# EAGLE schematic quantum_AnalougeEngine_V4_0 (EAGLE 9.5.2)

## Sheet 1 of 11: Voltages
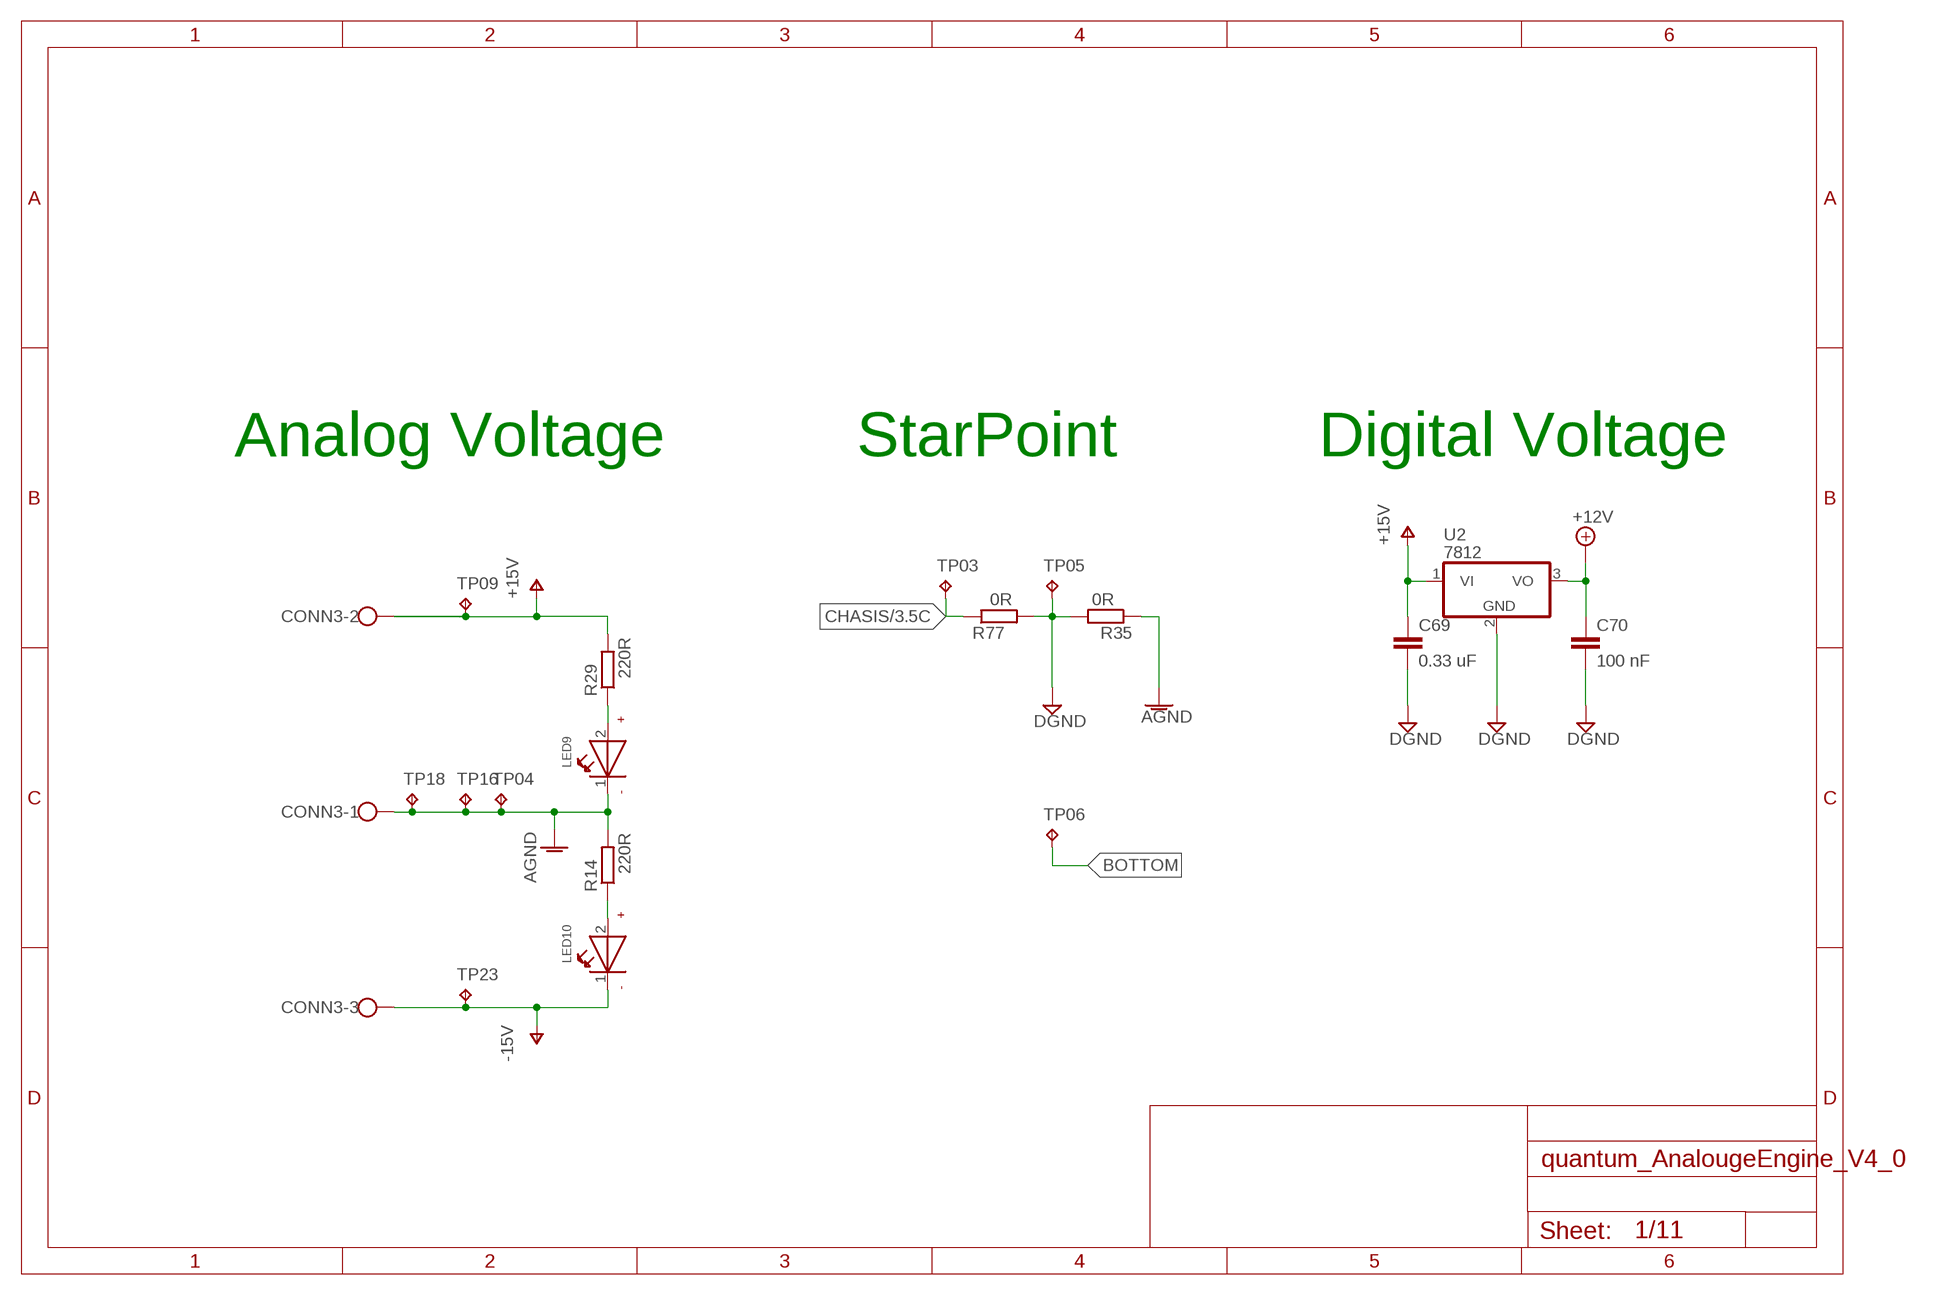
[diagram p0: schematic, sheet 1]

### Parts
C69  0.33 uF  CAPACITOR"  [C0603]
C70  100 nF  CAPACITOR"  [C0603]
CONN3  SCHRAUBKLEMME_3POL  [W237-103]
LED9  LED_GREEN_SMD  [WL-SMCW_0603]
LED10  LED_GREEN_SMD  [WL-SMCW_0603]
R14  220R  RESISTOR  [R0603]
R29  220R  RESISTOR  [R0603]
R35  0R  RESISTOR  [R0603]
R77  0R  RESISTOR  [R0603]
TP03  TPTHT  [THT_PIN]
TP04  TPTHT  [THT_PIN]
TP05  TPTHT  [THT_PIN]
TP06  TPTHT  [THT_PIN]
TP09  TPTHT  [THT_PIN]
TP16  TPTHT  [THT_PIN]
TP18  TPTHT  [THT_PIN]
TP23  TPTHT  [THT_PIN]
U2  7812  78  [TO252]

### Nets
+12V: C70.1 U2.3(VO) ; also sheet 2,9
AGND: CONN3.1 LED9.1(-) R14.2 R35.1 TP04.P$1(TP) TP16.P$1(TP) TP18.P$1(TP) ; also sheet 3,4,5,6,7,8,10,11
BOTTOM: TP06.P$1(TP)
CHASIS: R77.1 TP03.P$1(TP) ; also sheet 3,4
DGND: C69.2 C70.2 R35.2 R77.2 TP05.P$1(TP) U2.2(GND) ; also sheet 2,9,10,11
N$50: LED10.2(+) R14.1
N$52: LED9.2(+) R29.1
V+: C69.1 CONN3.2 R29.2 TP09.P$1(TP) U2.1(VI) ; supply symbol labelled +15V ; also sheet 3,4,5,6,7,8,10,11
V-: CONN3.3 LED10.1(-) TP23.P$1(TP) ; supply symbol labelled -15V ; also sheet 3,4,5,6,7,8,10,11

### Notes on the sheet
- Analog Voltage | StarPoint | Digital Voltage

## Sheet 2 of 11: Relais
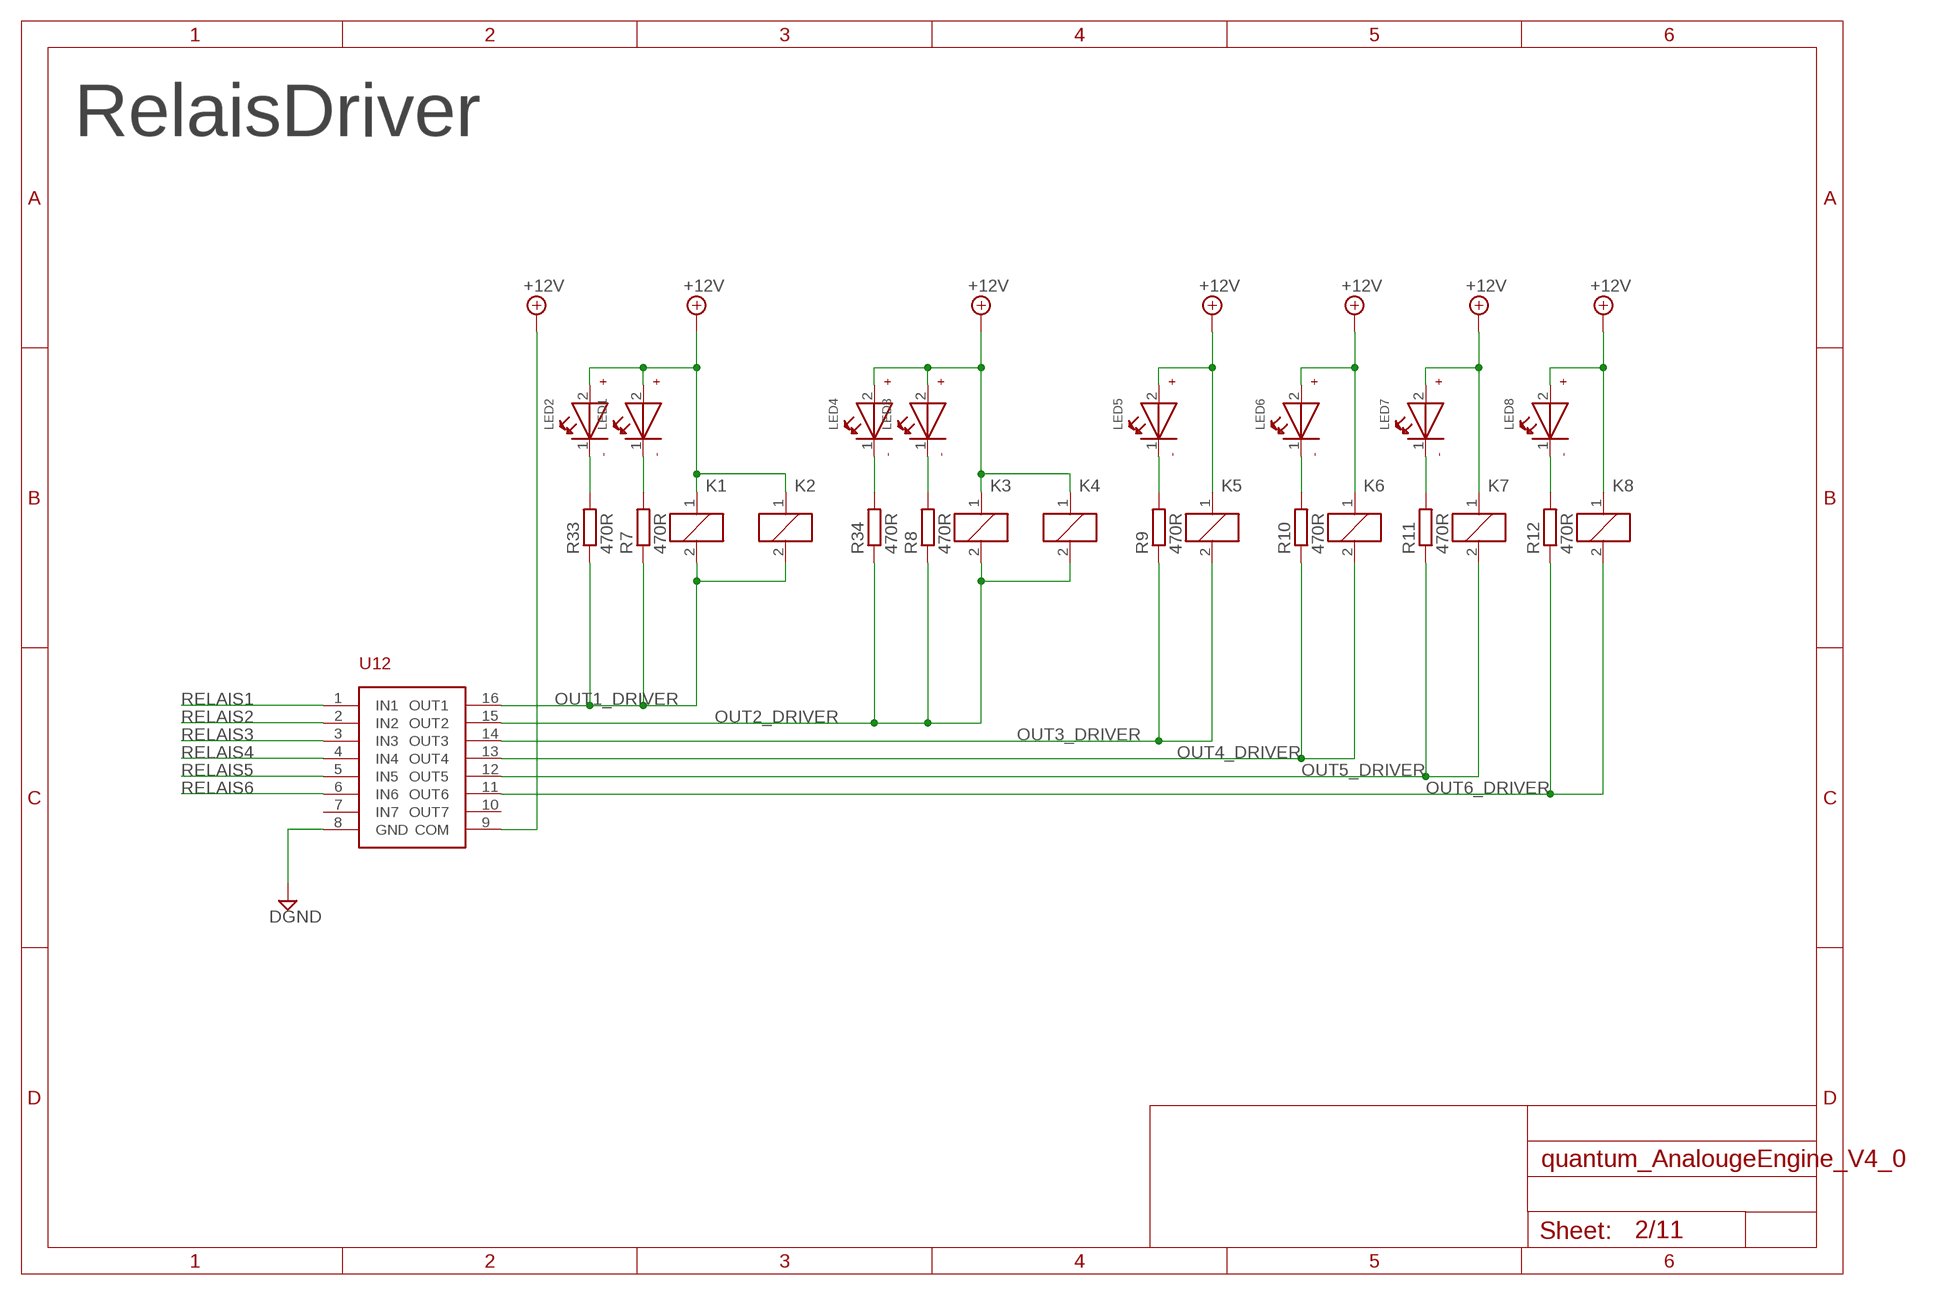
[diagram p1: schematic, sheet 2]

### Parts
K1  K1  RELAY_EE2-5NU  [351]
K2  K2  RELAY_EE2-5NU  [351]
K3  K3  RELAY_EE2-5NU  [351]
K4  K4  RELAY_EE2-5NU  [351]
K5  K5  RELAY_EE2-5NU  [351]
K6  K6  RELAY_EE2-5NU  [351]
K7  K7  RELAY_EE2-5NU  [351]
K8  K8  RELAY_EE2-5NU  [351]
LED1  LED_BLUE_SMD  [WL-SMCW_0603]
LED2  LED_BLUE_SMD  [WL-SMCW_0603]
LED3  LED_BLUE_SMD  [WL-SMCW_0603]
LED4  LED_BLUE_SMD  [WL-SMCW_0603]
LED5  LED_BLUE_SMD  [WL-SMCW_0603]
LED6  LED_BLUE_SMD  [WL-SMCW_0603]
LED7  LED_BLUE_SMD  [WL-SMCW_0603]
LED8  LED_BLUE_SMD  [WL-SMCW_0603]
R7  470R  RESISTOR  [R0603]
R8  470R  RESISTOR  [R0603]
R9  470R  RESISTOR  [R0603]
R10  470R  RESISTOR  [R0603]
R11  470R  RESISTOR  [R0603]
R12  470R  RESISTOR  [R0603]
R33  470R  RESISTOR  [R0603]
R34  470R  RESISTOR  [R0603]
U12  ULN2003  [SOIC16]

### Nets
+12V: K1.1 K2.1 K3.1 K4.1 K5.1 K6.1 K7.1 K8.1 LED1.2(+) LED2.2(+) LED3.2(+) LED4.2(+) LED5.2(+) LED6.2(+) LED7.2(+) LED8.2(+) U12.9(COM) ; also sheet 1,9
DGND: U12.8(GND) ; also sheet 1,9,10,11
N$14: LED1.1(-) R7.2
N$16: LED3.1(-) R8.2
N$26: LED8.1(-) R12.2
N$29: LED7.1(-) R11.2
N$30: LED6.1(-) R10.2
N$32: LED5.1(-) R9.2
N$49: LED2.1(-) R33.2
N$51: LED4.1(-) R34.2
OUT1_DRIVER: K1.2 K2.2 R7.1 R33.1 U12.16(OUT1)
OUT2_DRIVER: K3.2 K4.2 R8.1 R34.1 U12.15(OUT2)
OUT3_DRIVER: K5.2 R9.1 U12.14(OUT3)
OUT4_DRIVER: K6.2 R10.1 U12.13(OUT4)
OUT5_DRIVER: K7.2 R11.1 U12.12(OUT5)
OUT6_DRIVER: K8.2 R12.1 U12.11(OUT6)
RELAIS1: U12.1(IN1) ; also sheet 9
RELAIS2: U12.2(IN2) ; also sheet 9
RELAIS3: U12.3(IN3) ; also sheet 9
RELAIS4: U12.4(IN4) ; also sheet 9
RELAIS5: U12.5(IN5) ; also sheet 9
RELAIS6: U12.6(IN6) ; also sheet 9
Unconnected: U12.7(IN7) U12.10(OUT7)

### Notes on the sheet
- RelaisDriver

## Sheet 3 of 11: Right I/O Section
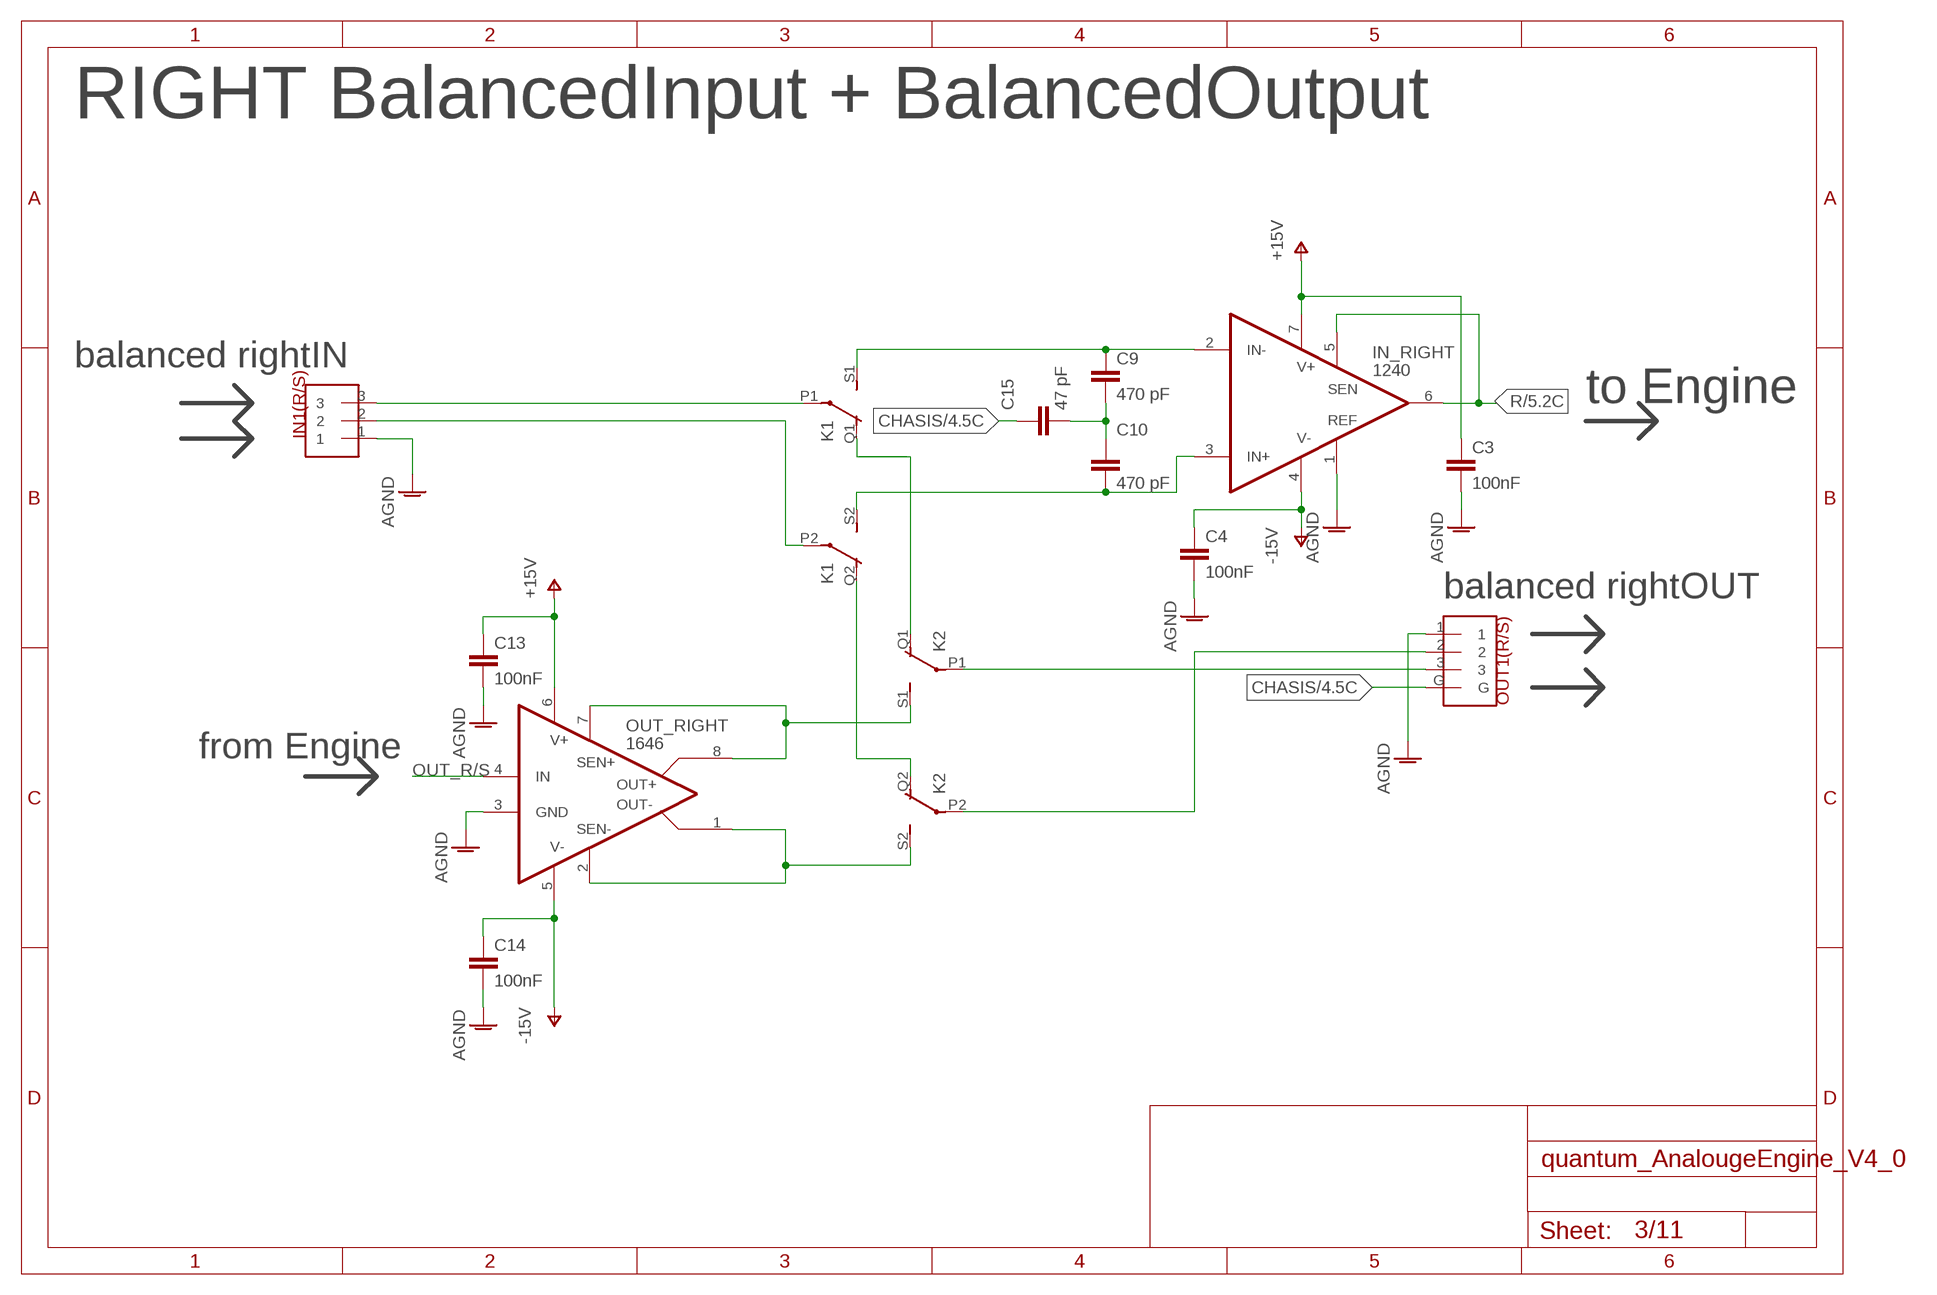
[diagram p2: schematic, sheet 3]

### Parts
C3  100nF  CAPACITOR"  [C0603]
C4  100nF  CAPACITOR"  [C0603]
C9  470 pF  CAPACITOR"  [C0603]
C10  470 pF  CAPACITOR"  [C0603]
C13  100nF  CAPACITOR"  [C0603]
C14  100nF  CAPACITOR"  [C0603]
C15  47 pF  CAPACITOR"  [C0603]
IN1(R/S)  NEUTRIK_NC3FAH  [NEUTRIK_NC3FAH]
IN_RIGHT  1240  THAT1240SO8-USO8-U  [SO08]
OUT1(R/S)  NEUTRIK_NC3MAH  [NEUTRIK_NC3MAH]
OUT_RIGHT  1646  THAT1646SO8-USO8-U  [SO08]

### Nets
AGND: C3.2 C4.2 C13.2 C14.2 IN1(R/S).1 IN_RIGHT.1(REF) OUT1(R/S).1 OUT_RIGHT.3(GND) ; also sheet 1,4,5,6,7,8,10,11
CHASIS: C15.1 OUT1(R/S).G ; also sheet 1,4
N$1: C9.1 IN_RIGHT.2(IN-) K1.S1(2:S)
N$2: C10.2 IN_RIGHT.3(IN+) K1.S2(3:S)
N$3: C9.2 C10.1 C15.2
N$8: K1.Q1(2:O) K2.Q1(2:O)
N$11: K1.Q2(3:O) K2.Q2(3:O)
N$21: IN1(R/S).2 K1.P2(3:P)
N$22: IN1(R/S).3 K1.P1(2:P)
N$23: K2.P2(3:P) OUT1(R/S).2
N$24: K2.P1(2:P) OUT1(R/S).3
OUT_R/S: OUT_RIGHT.4(IN) ; also sheet 8
R: IN_RIGHT.5(SEN) IN_RIGHT.6(OUT) ; also sheet 5
R/S_OUT+: K2.S1(2:S) OUT_RIGHT.7(SEN+) OUT_RIGHT.8(OUT+)
R/S_OUT-: K2.S2(3:S) OUT_RIGHT.1(OUT-) OUT_RIGHT.2(SEN-)
V+: C3.1 C13.1 IN_RIGHT.7(V+) OUT_RIGHT.6(V+) ; supply symbol labelled +15V ; also sheet 1,4,5,6,7,8,10,11
V-: C4.1 C14.1 IN_RIGHT.4(V-) OUT_RIGHT.5(V-) ; supply symbol labelled -15V ; also sheet 1,4,5,6,7,8,10,11

### Notes on the sheet
- RIGHT BalancedInput + BalancedOutput
- balanced rightIN
- to Engine
- balanced rightOUT
- from Engine

## Sheet 4 of 11: Left I/O Section
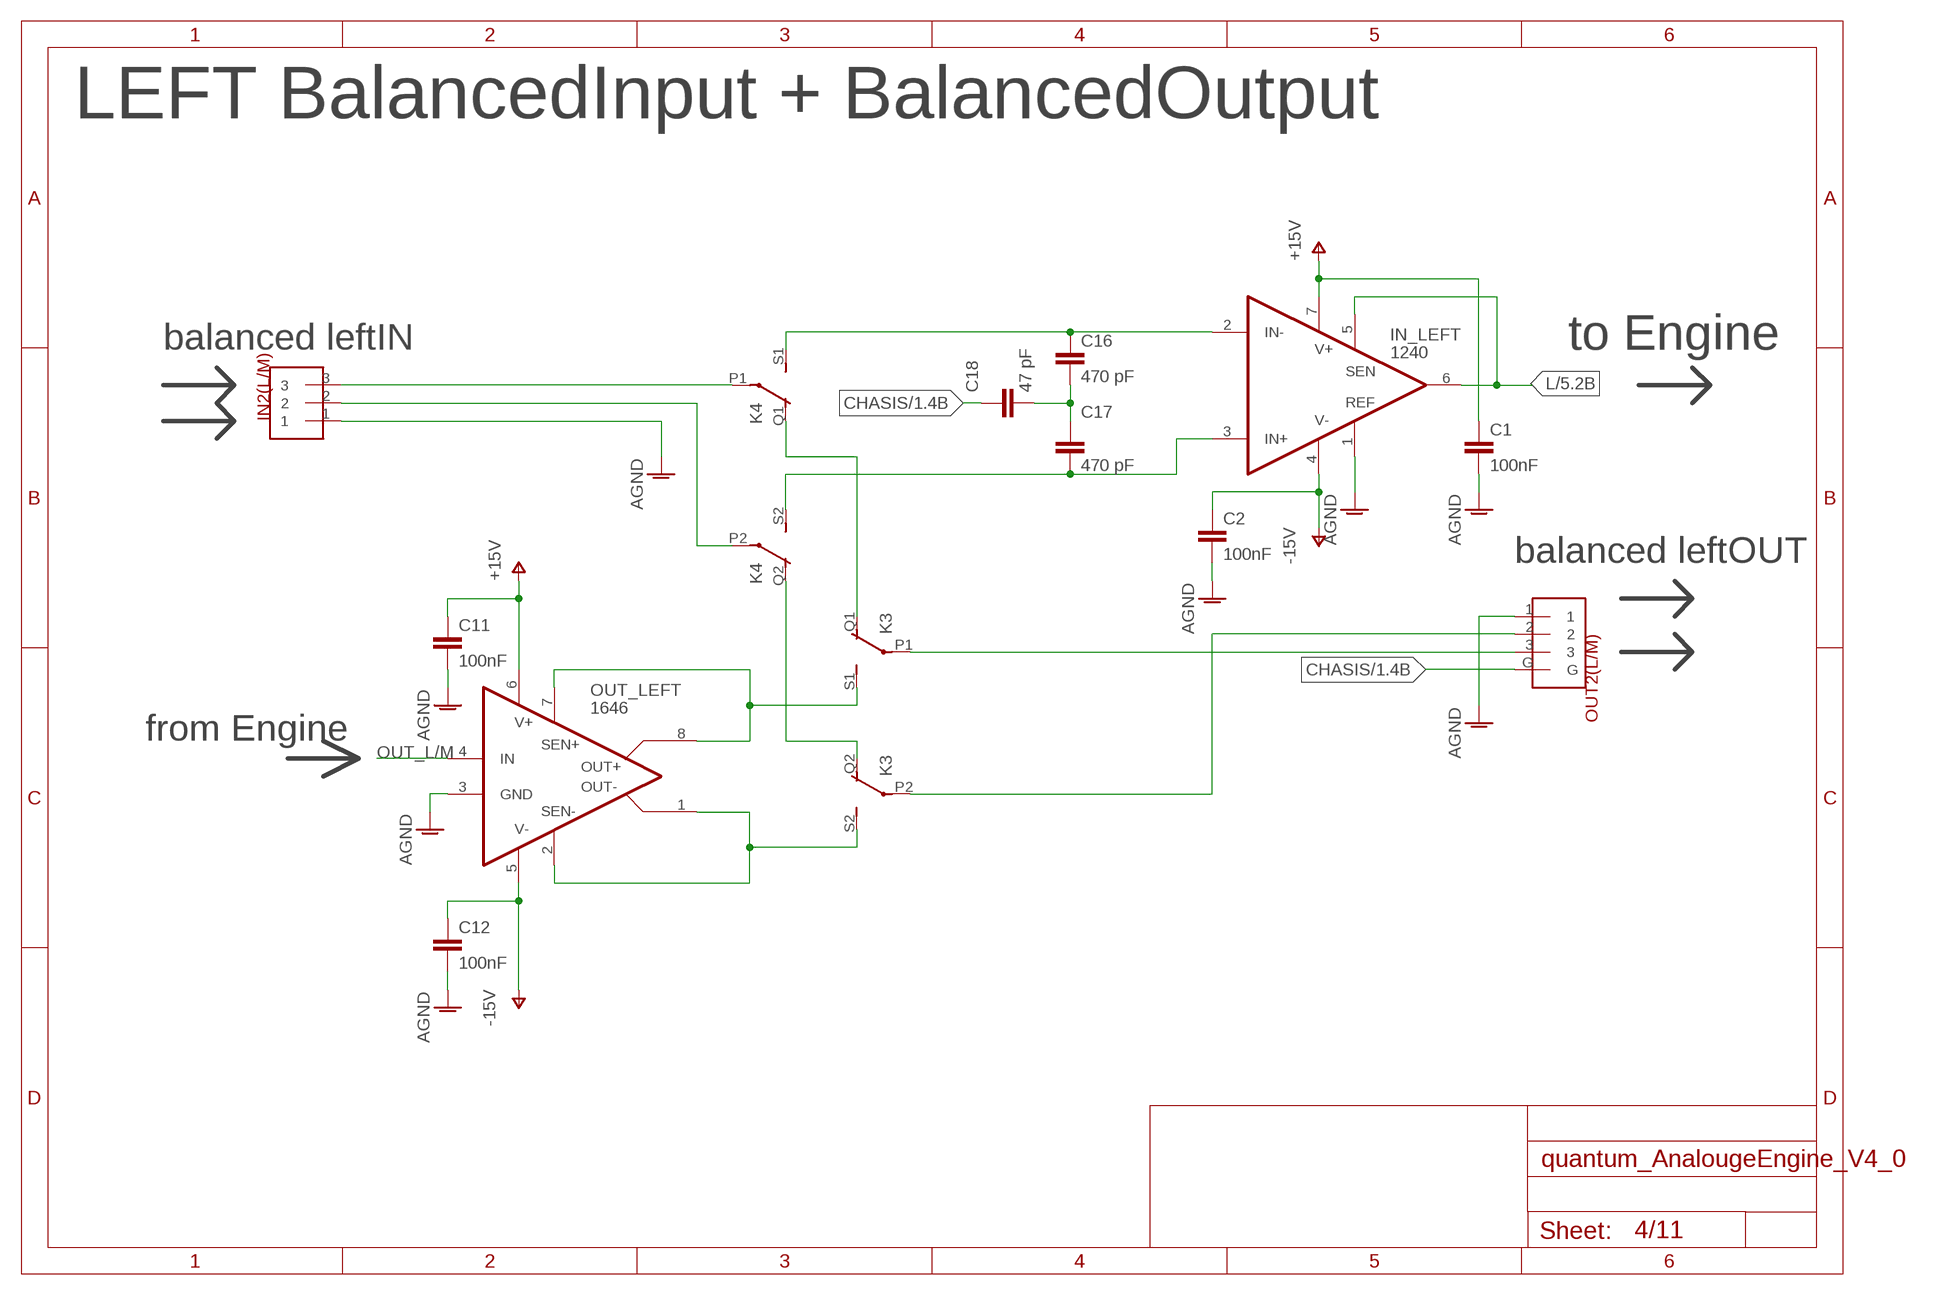
[diagram p3: schematic, sheet 4]

### Parts
C1  100nF  CAPACITOR"  [C0603]
C2  100nF  CAPACITOR"  [C0603]
C11  100nF  CAPACITOR"  [C0603]
C12  100nF  CAPACITOR"  [C0603]
C16  470 pF  CAPACITOR"  [C0603]
C17  470 pF  CAPACITOR"  [C0603]
C18  47 pF  CAPACITOR"  [C0603]
IN2(L/M)  NEUTRIK_NC3FAH  [NEUTRIK_NC3FAH]
IN_LEFT  1240  THAT1240SO8-USO8-U  [SO08]
OUT2(L/M)  NEUTRIK_NC3MAH  [NEUTRIK_NC3MAH]
OUT_LEFT  1646  THAT1646SO8-USO8-U  [SO08]

### Nets
AGND: C1.2 C2.2 C11.2 C12.2 IN2(L/M).1 IN_LEFT.1(REF) OUT2(L/M).1 OUT_LEFT.3(GND) ; also sheet 1,3,5,6,7,8,10,11
CHASIS: C18.1 OUT2(L/M).G ; also sheet 1,3
L: IN_LEFT.5(SEN) IN_LEFT.6(OUT) ; also sheet 5
L/M_OUT+: K3.S1(2:S) OUT_LEFT.7(SEN+) OUT_LEFT.8(OUT+)
L/M_OUT-: K3.S2(3:S) OUT_LEFT.1(OUT-) OUT_LEFT.2(SEN-)
N$7: C17.2 IN_LEFT.3(IN+) K4.S2(3:S)
N$9: C16.2 C17.1 C18.2
N$13: C16.1 IN_LEFT.2(IN-) K4.S1(2:S)
N$15: K3.P1(2:P) OUT2(L/M).3
N$17: K3.P2(3:P) OUT2(L/M).2
N$25: IN2(L/M).3 K4.P1(2:P)
N$27: IN2(L/M).2 K4.P2(3:P)
N$28: K3.Q1(2:O) K4.Q1(2:O)
N$31: K3.Q2(3:O) K4.Q2(3:O)
OUT_L/M: OUT_LEFT.4(IN) ; also sheet 8
V+: C1.1 C11.1 IN_LEFT.7(V+) OUT_LEFT.6(V+) ; supply symbol labelled +15V ; also sheet 1,3,5,6,7,8,10,11
V-: C2.1 C12.1 IN_LEFT.4(V-) OUT_LEFT.5(V-) ; supply symbol labelled -15V ; also sheet 1,3,5,6,7,8,10,11

### Notes on the sheet
- LEFT BalancedInput + BalancedOutput
- balanced leftIN | to Engine
- balanced leftOUT
- from Engine

## Sheet 5 of 11: MS Encode
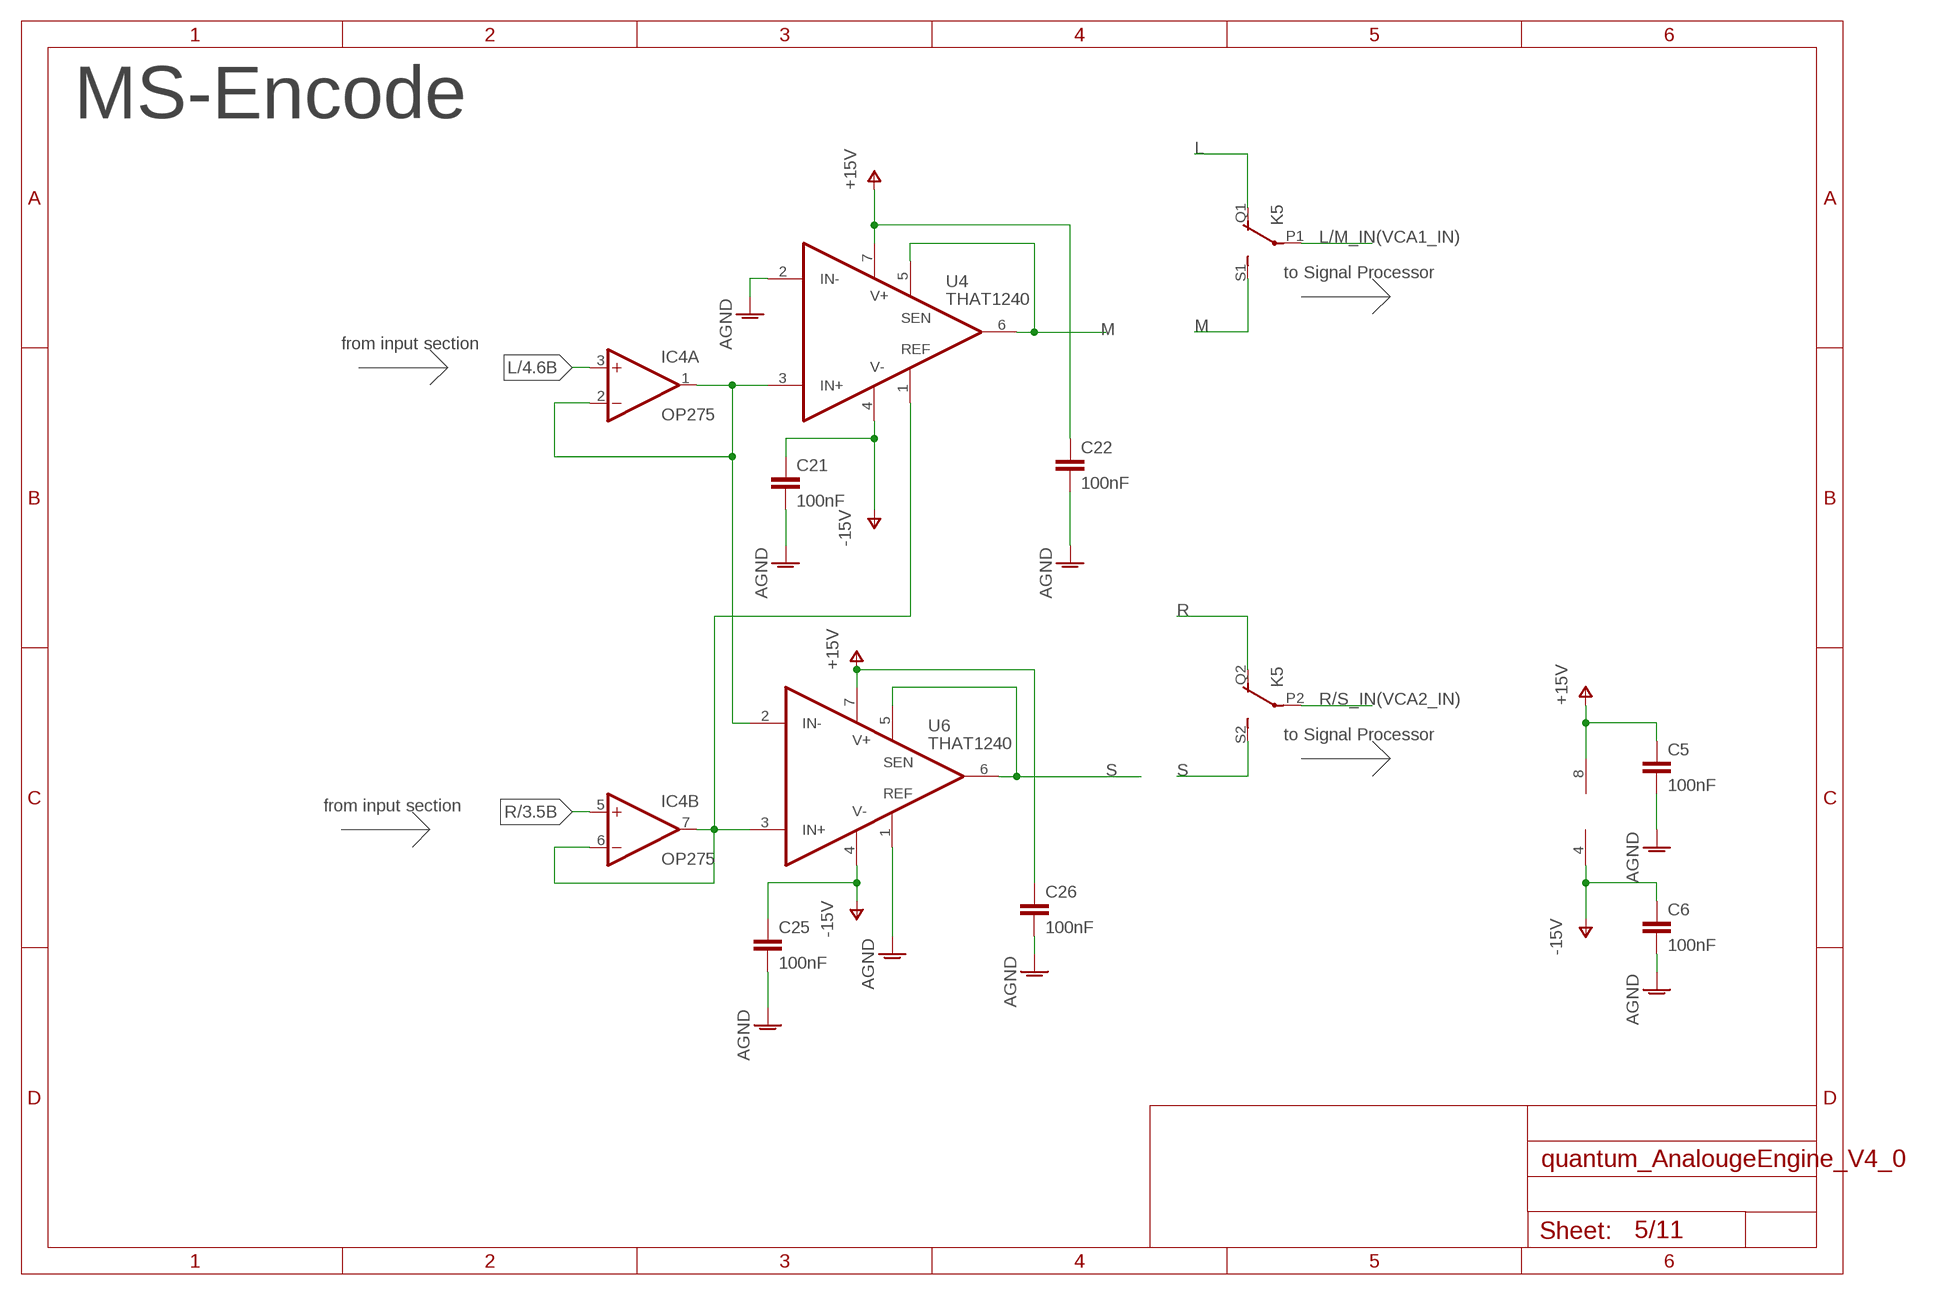
[diagram p4: schematic, sheet 5]

### Parts
C5  100nF  CAPACITOR"  [C0603]
C6  100nF  CAPACITOR"  [C0603]
C21  100nF  CAPACITOR"  [C0603]
C22  100nF  CAPACITOR"  [C0603]
C25  100nF  CAPACITOR"  [C0603]
C26  100nF  CAPACITOR"  [C0603]
IC4  OP275  [SOIC8]
U4  THAT1240  THAT1240SO8-USO8-U  [SO08]
U6  THAT1240  THAT1240SO8-USO8-U  [SO08]

### Nets
AGND: C5.2 C6.2 C21.2 C22.2 C25.2 C26.2 U4.2(IN-) U6.1(REF) ; also sheet 1,3,4,6,7,8,10,11
L: IC4.3(A:+IN) K5.Q1(2:O) ; also sheet 4
L/M_IN(VCA1_IN): K5.P1(2:P) ; also sheet 6,10
M: K5.S1(2:S) U4.5(SEN) U4.6(OUT)
N$18: IC4.1(A:OUT) IC4.2(A:-IN) U4.3(IN+) U6.2(IN-)
N$33: IC4.6(B:-IN) IC4.7(B:OUT) U4.1(REF) U6.3(IN+)
R: IC4.5(B:+IN) K5.Q2(3:O) ; also sheet 3
R/S_IN(VCA2_IN): K5.P2(3:P) ; also sheet 6,10
S: K5.S2(3:S) U6.5(SEN) U6.6(OUT)
V+: C5.1 C22.1 C26.1 IC4.8(P:V+) U4.7(V+) U6.7(V+) ; supply symbol labelled +15V ; also sheet 1,3,4,6,7,8,10,11
V-: C6.1 C21.1 C25.1 IC4.4(P:V-) U4.4(V-) U6.4(V-) ; supply symbol labelled -15V ; also sheet 1,3,4,6,7,8,10,11

### Notes on the sheet
- MS-Encode
- to Signal Processor
- from input section
- to Signal Processor
- from input section

## Sheet 6 of 11: VCA
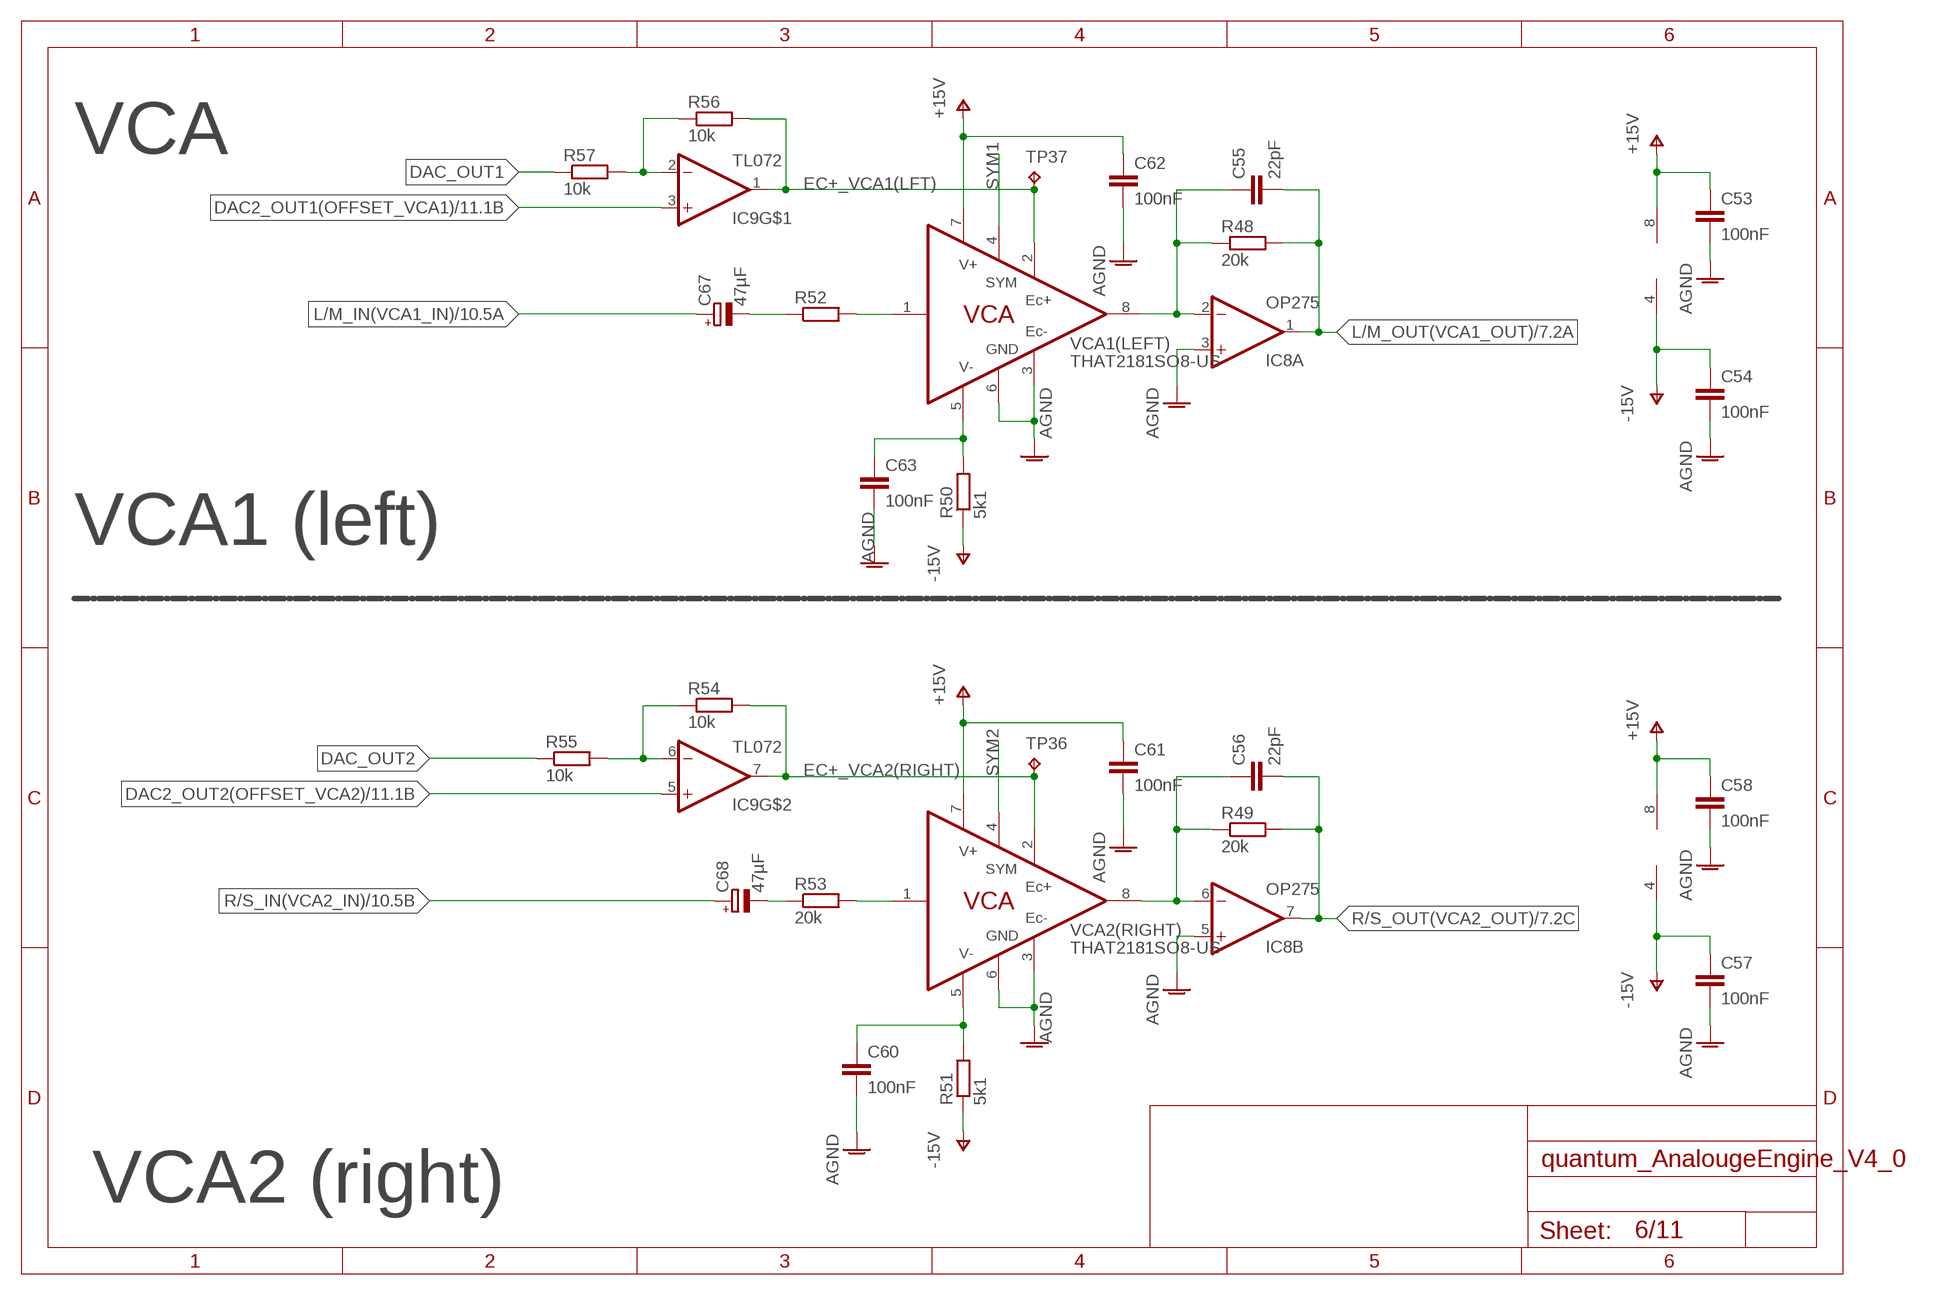
[diagram p5: schematic, sheet 6]

### Parts
C53  100nF  CAPACITOR"  [C0603]
C54  100nF  CAPACITOR"  [C0603]
C55  22pF  CAPACITOR"  [C0603]
C56  22pF  CAPACITOR"  [C0603]
C57  100nF  CAPACITOR"  [C0603]
C58  100nF  CAPACITOR"  [C0603]
C60  100nF  CAPACITOR"  [C0603]
C61  100nF  CAPACITOR"  [C0603]
C62  100nF  CAPACITOR"  [C0603]
C63  100nF  CAPACITOR"  [C0603]
C67  47µF  ELECTROLYTICELCTROLYTIC_MIDSIZE_SMD  [CAPAE400X550N]
C68  47µF  ELECTROLYTICELCTROLYTIC_MIDSIZE_SMD  [CAPAE400X550N]
IC8  OP275  [SOIC8]
IC9  TL072  [SOIC8]
R48  20k  RESISTOR  [R0603]
R49  20k  RESISTOR  [R0603]
R50  5k1  RESISTOR  [R0603]
R51  5k1  RESISTOR  [R0603]
R52  20k  RESISTOR  [R0603]
R53  20k  RESISTOR  [R0603]
R54  10k  RESISTOR  [R0603]
R55  10k  RESISTOR  [R0603]
R56  10k  RESISTOR  [R0603]
R57  10k  RESISTOR  [R0603]
TP36  TPTHT  [THT_PIN]
TP37  TPTHT  [THT_PIN]
VCA1(LEFT)  THAT2181SO8-US  [SO08]
VCA2(RIGHT)  THAT2181SO8-US  [SO08]

### Nets
AGND: C53.2 C54.2 C57.2 C58.2 C60.2 C61.2 C62.2 C63.2 IC8.3(A:+IN) IC8.5(B:+IN) VCA1(LEFT).3(EC-) VCA1(LEFT).6(GND) VCA2(RIGHT).3(EC-) VCA2(RIGHT).6(GND) ; also sheet 1,3,4,5,7,8,10,11
DAC2_OUT1(OFFSET_VCA1): IC9.3(+IN) ; also sheet 11
DAC2_OUT2(OFFSET_VCA2): IC9.5(+IN) ; also sheet 11
DAC_OUT1: R57.1 ; also sheet 9
DAC_OUT2: R55.1 ; also sheet 9
EC+_VCA1(LFT): IC9.1(OUT) R56.2 TP37.P$1(TP) VCA1(LEFT).2(EC+)
EC+_VCA2(RIGHT): IC9.7(OUT) R54.2 TP36.P$1(TP) VCA2(RIGHT).2(EC+)
L/M_IN(VCA1_IN): C67.1(+) ; also sheet 5,10
L/M_OUT(VCA1_OUT): C55.2 IC8.1(A:OUT) R48.2 ; also sheet 7,10
N$63: IC9.2(-IN) R56.1 R57.2
N$64: C55.1 IC8.2(A:-IN) R48.1 VCA1(LEFT).8(OUT)
N$65: R52.2 VCA1(LEFT).1(IN)
N$71: C67.2(-) R52.1
N$75: C56.1 IC8.6(B:-IN) R49.1 VCA2(RIGHT).8(OUT)
N$77: C60.1 R51.2 VCA2(RIGHT).5(V-)
N$78: C68.2(-) R53.1
N$79: R53.2 VCA2(RIGHT).1(IN)
N$80: C63.1 R50.2 VCA1(LEFT).5(V-)
N$81: IC9.6(-IN) R54.1 R55.2
R/S_IN(VCA2_IN): C68.1(+) ; also sheet 5,10
R/S_OUT(VCA2_OUT): C56.2 IC8.7(B:OUT) R49.2 ; also sheet 7,10
SYM1: VCA1(LEFT).4(SYM) ; also sheet 11
SYM2: VCA2(RIGHT).4(SYM) ; also sheet 11
V+: C53.1 C58.1 C61.1 C62.1 IC8.8(P:V+) IC9.8(V+) VCA1(LEFT).7(V+) VCA2(RIGHT).7(V+) ; supply symbol labelled +15V ; also sheet 1,3,4,5,7,8,10,11
V-: C54.1 C57.1 IC8.4(P:V-) IC9.4(V-) R50.1 R51.1 ; supply symbol labelled -15V ; also sheet 1,3,4,5,7,8,10,11

### Notes on the sheet
- VCA
- VCA1 (left)
- VCA2 (right)

## Sheet 7 of 11: Output Stage
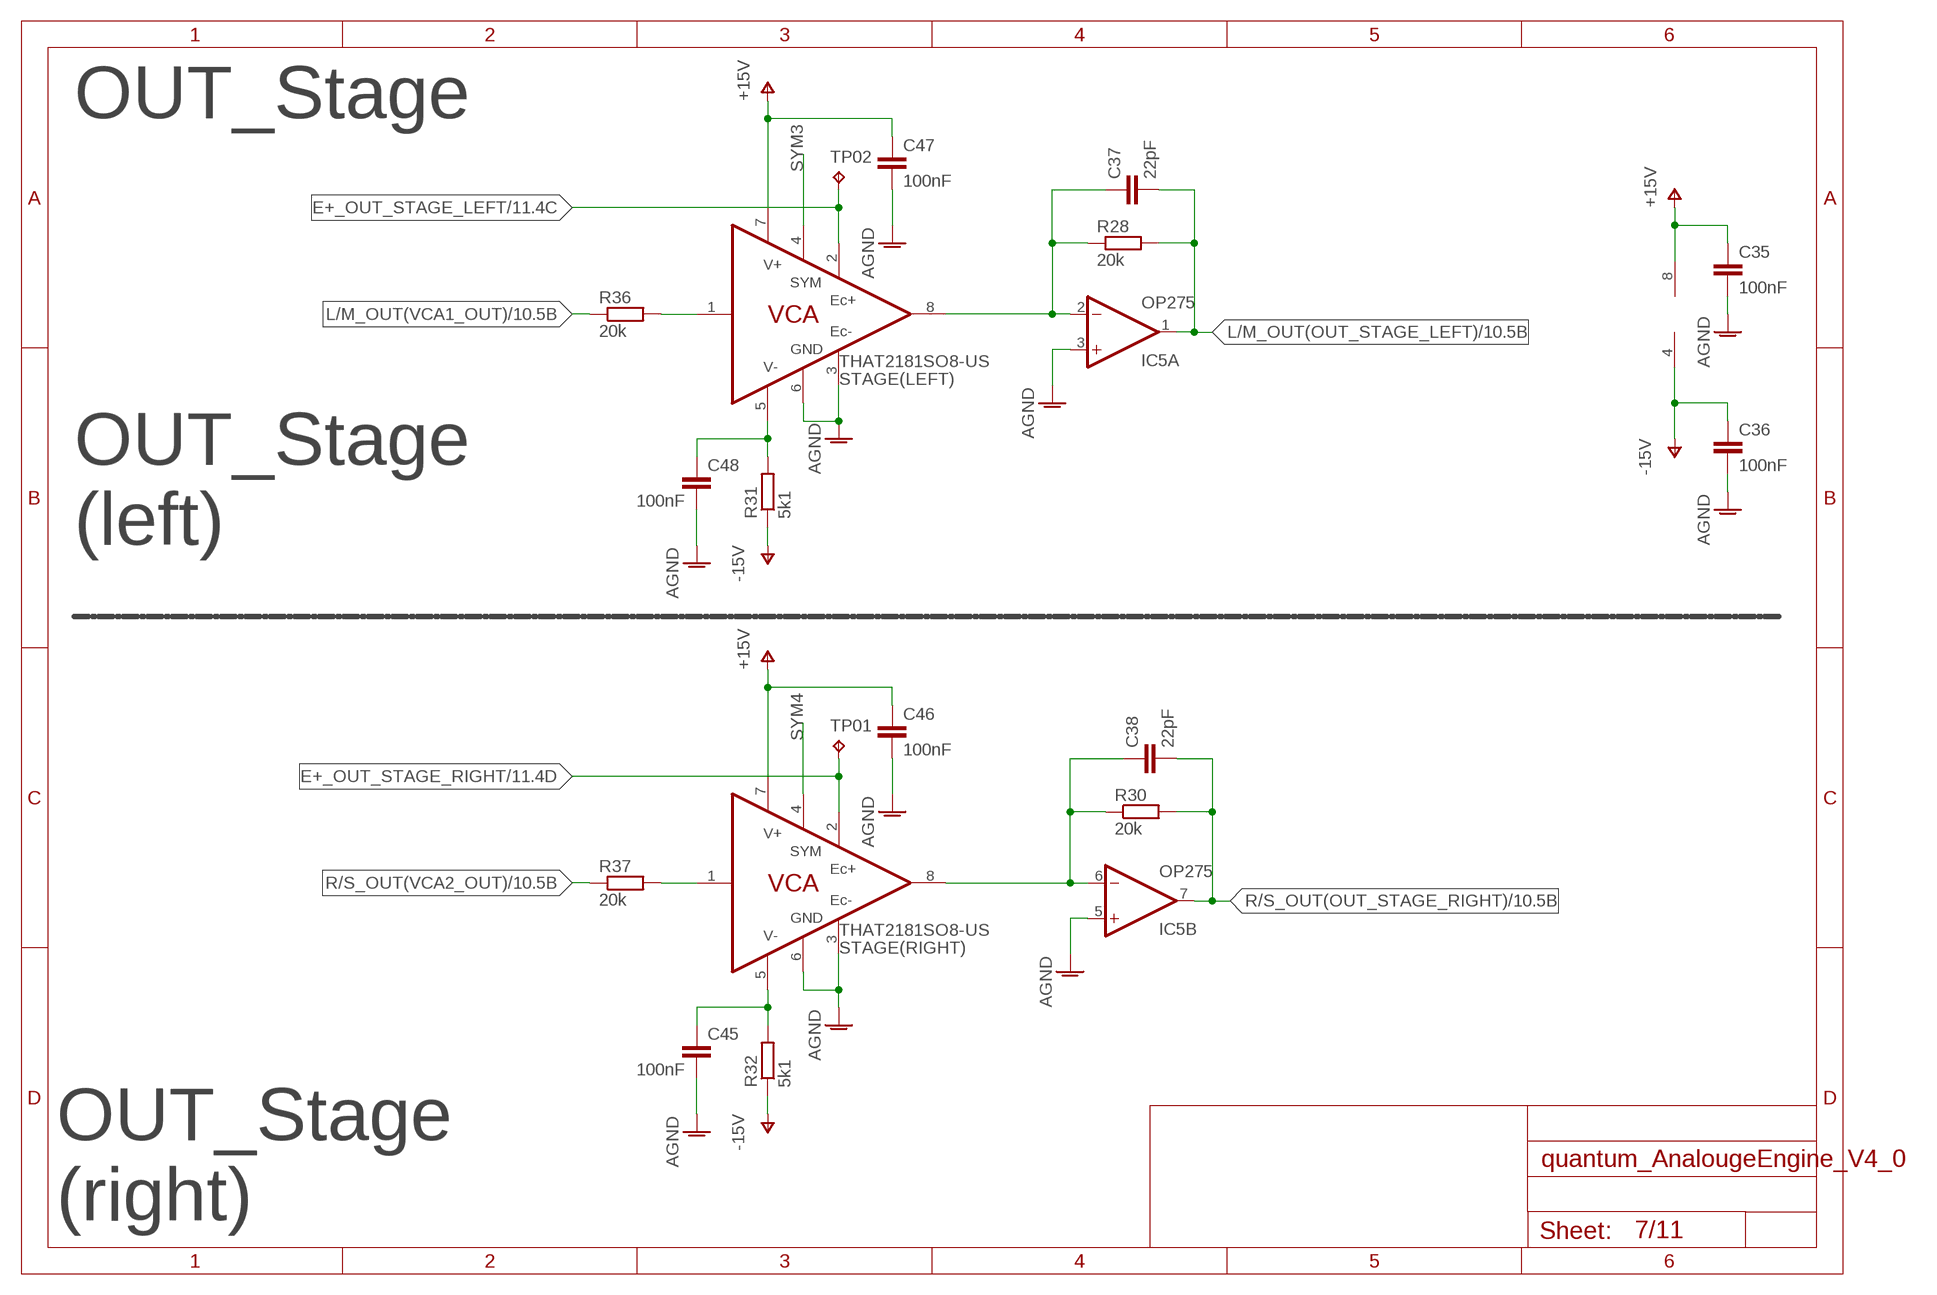
[diagram p6: schematic, sheet 7]

### Parts
C35  100nF  CAPACITOR"  [C0603]
C36  100nF  CAPACITOR"  [C0603]
C37  22pF  CAPACITOR"  [C0603]
C38  22pF  CAPACITOR"  [C0603]
C45  100nF  CAPACITOR"  [C0603]
C46  100nF  CAPACITOR"  [C0603]
C47  100nF  CAPACITOR"  [C0603]
C48  100nF  CAPACITOR"  [C0603]
IC5  OP275  [SOIC8]
R28  20k  RESISTOR  [R0603]
R30  20k  RESISTOR  [R0603]
R31  5k1  RESISTOR  [R0603]
R32  5k1  RESISTOR  [R0603]
R36  20k  RESISTOR  [R0603]
R37  20k  RESISTOR  [R0603]
STAGE(LEFT)  THAT2181SO8-US  [SO08]
STAGE(RIGHT)  THAT2181SO8-US  [SO08]
TP01  TPTHT  [THT_PIN]
TP02  TPTHT  [THT_PIN]

### Nets
AGND: C35.2 C36.2 C45.2 C46.2 C47.2 C48.2 IC5.3(A:+IN) IC5.5(B:+IN) STAGE(LEFT).3(EC-) STAGE(LEFT).6(GND) STAGE(RIGHT).3(EC-) STAGE(RIGHT).6(GND) ; also sheet 1,3,4,5,6,8,10,11
E+_OUT_STAGE_LEFT: STAGE(LEFT).2(EC+) TP02.P$1(TP) ; also sheet 11
E+_OUT_STAGE_RIGHT: STAGE(RIGHT).2(EC+) TP01.P$1(TP) ; also sheet 11
L/M_OUT(OUT_STAGE_LEFT): C37.2 IC5.1(A:OUT) R28.2 ; also sheet 8,10
L/M_OUT(VCA1_OUT): R36.1 ; also sheet 6,10
N$48: C37.1 IC5.2(A:-IN) R28.1 STAGE(LEFT).8(OUT)
N$53: C38.1 IC5.6(B:-IN) R30.1 STAGE(RIGHT).8(OUT)
N$54: C45.1 R32.2 STAGE(RIGHT).5(V-)
N$55: R36.2 STAGE(LEFT).1(IN)
N$68: R37.2 STAGE(RIGHT).1(IN)
N$73: C48.1 R31.2 STAGE(LEFT).5(V-)
R/S_OUT(OUT_STAGE_RIGHT): C38.2 IC5.7(B:OUT) R30.2 ; also sheet 8,10
R/S_OUT(VCA2_OUT): R37.1 ; also sheet 6,10
SYM3: STAGE(LEFT).4(SYM) ; also sheet 11
SYM4: STAGE(RIGHT).4(SYM) ; also sheet 11
V+: C35.1 C46.1 C47.1 IC5.8(P:V+) STAGE(LEFT).7(V+) STAGE(RIGHT).7(V+) ; supply symbol labelled +15V ; also sheet 1,3,4,5,6,8,10,11
V-: C36.1 IC5.4(P:V-) R31.1 R32.1 ; supply symbol labelled -15V ; also sheet 1,3,4,5,6,8,10,11

### Notes on the sheet
- OUT_Stage
- OUT_Stage 
  (left)
- OUT_Stage 
  (right)

## Sheet 8 of 11: MS Decode
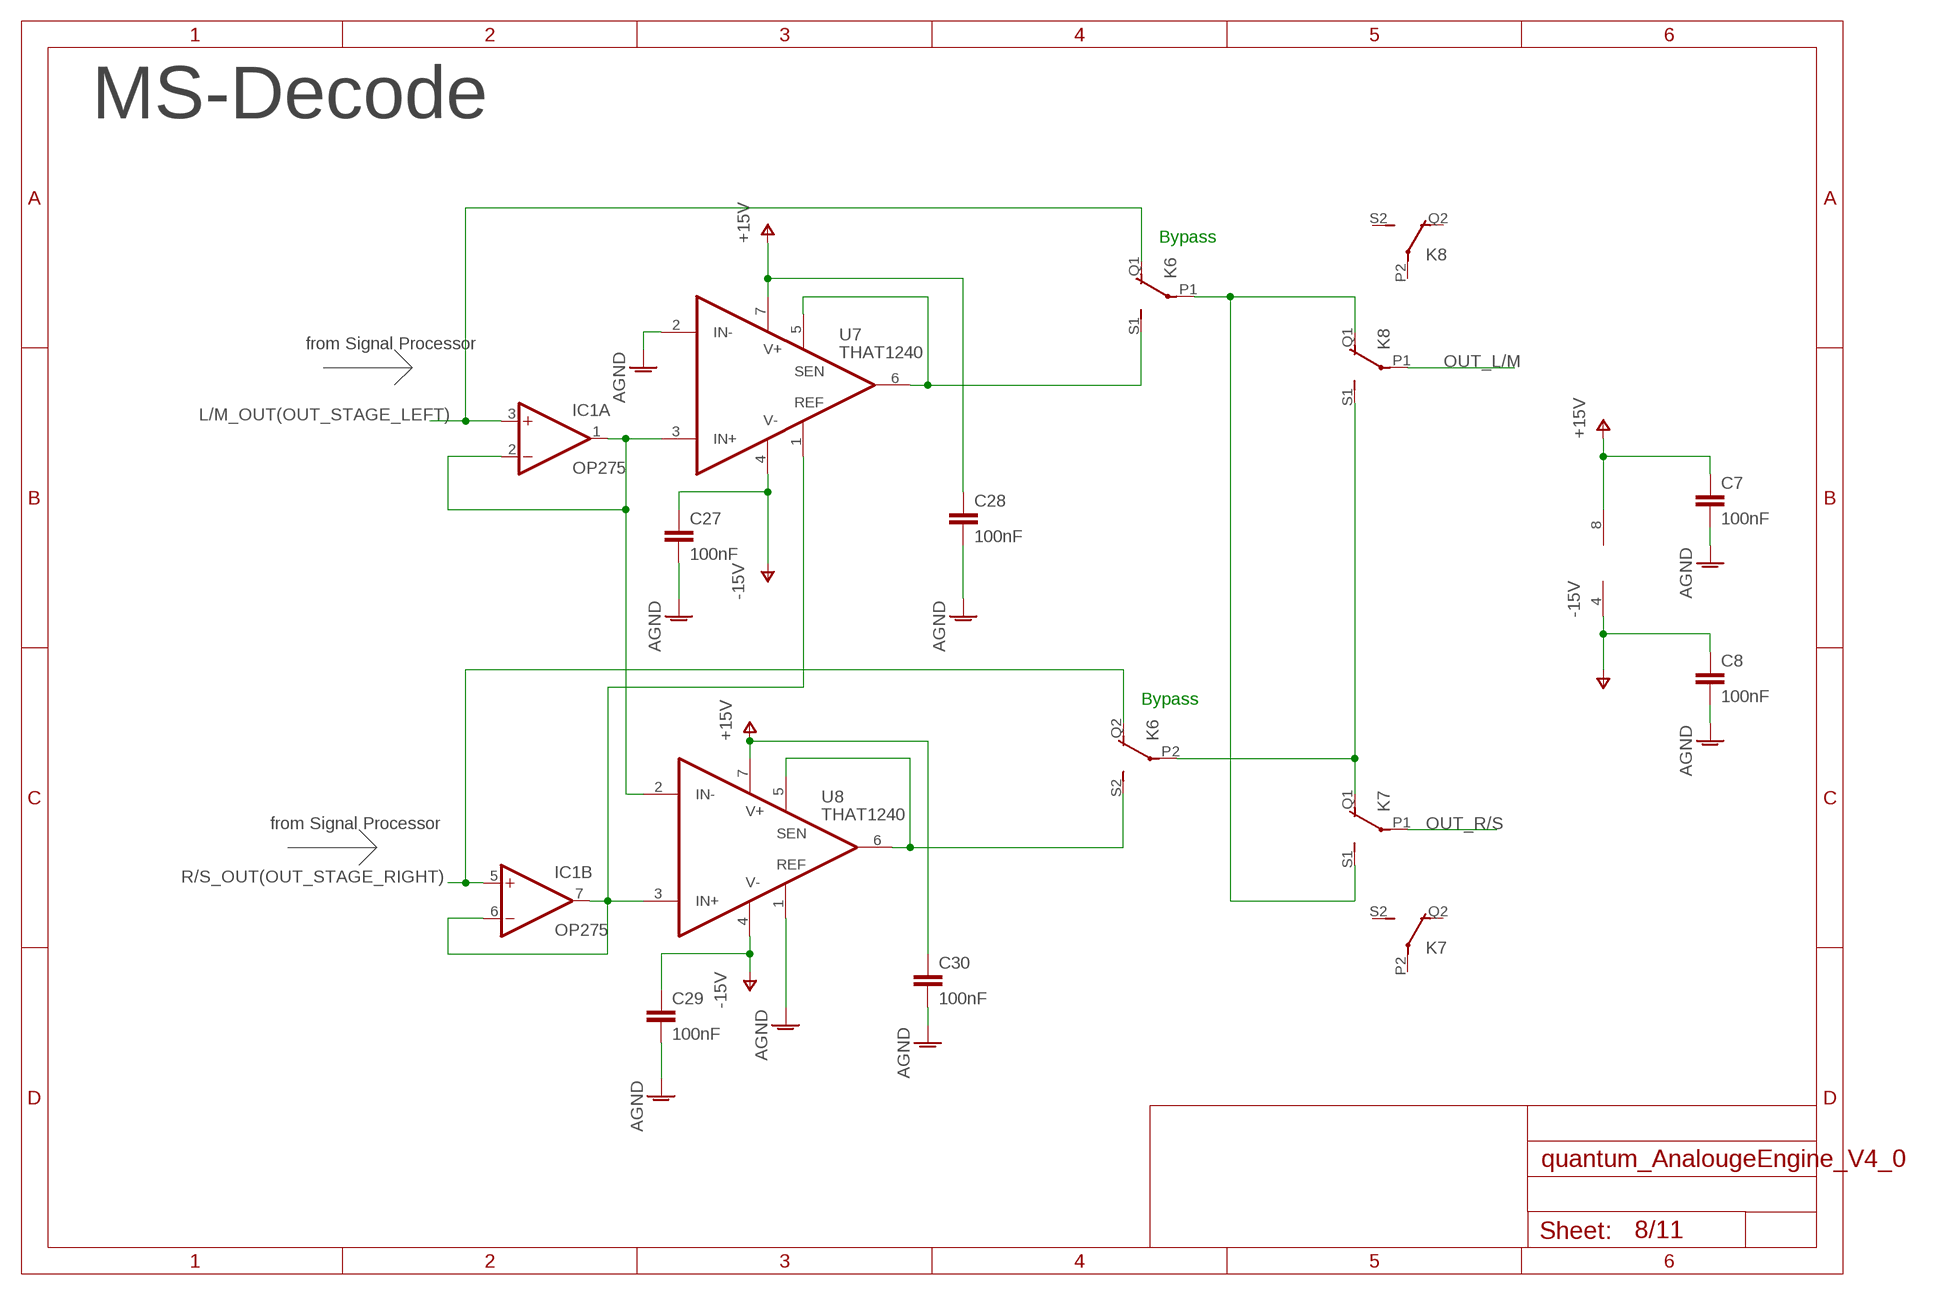
[diagram p7: schematic, sheet 8]

### Parts
C7  100nF  CAPACITOR"  [C0603]
C8  100nF  CAPACITOR"  [C0603]
C27  100nF  CAPACITOR"  [C0603]
C28  100nF  CAPACITOR"  [C0603]
C29  100nF  CAPACITOR"  [C0603]
C30  100nF  CAPACITOR"  [C0603]
IC1  OP275  [SOIC8]
U7  THAT1240  THAT1240SO8-USO8-U  [SO08]
U8  THAT1240  THAT1240SO8-USO8-U  [SO08]

### Nets
AGND: C7.2 C8.2 C27.2 C28.2 C29.2 C30.2 U7.2(IN-) U8.1(REF) ; also sheet 1,3,4,5,6,7,10,11
L/M_OUT(OUT_STAGE_LEFT): IC1.3(A:+IN) K6.Q1(2:O) ; also sheet 7,10
M1: K6.S1(2:S) U7.5(SEN) U7.6(OUT)
N$5: K6.P1(2:P) K7.S1(2:S) K8.Q1(2:O)
N$19: K6.P2(3:P) K7.Q1(2:O) K8.S1(2:S)
N$43: IC1.6(B:-IN) IC1.7(B:OUT) U7.1(REF) U8.3(IN+)
N$45: IC1.1(A:OUT) IC1.2(A:-IN) U7.3(IN+) U8.2(IN-)
OUT_L/M: K8.P1(2:P) ; also sheet 4
OUT_R/S: K7.P1(2:P) ; also sheet 3
R/S_OUT(OUT_STAGE_RIGHT): IC1.5(B:+IN) K6.Q2(3:O) ; also sheet 7,10
S1: K6.S2(3:S) U8.5(SEN) U8.6(OUT)
V+: C7.1 C28.1 C30.1 IC1.8(P:V+) U7.7(V+) U8.7(V+) ; supply symbol labelled +15V ; also sheet 1,3,4,5,6,7,10,11
V-: C8.1 C27.1 C29.1 IC1.4(P:V-) U7.4(V-) U8.4(V-) ; supply symbol labelled -15V ; also sheet 1,3,4,5,6,7,10,11
Unconnected: K7.P2(3:P) K7.Q2(3:O) K7.S2(3:S) K8.P2(3:P) K8.Q2(3:O) K8.S2(3:S)

### Notes on the sheet
- MS-Decode
- Bypass
- from Signal Processor
- Bypass
- from Signal Processor

## Sheet 9 of 11: Controller
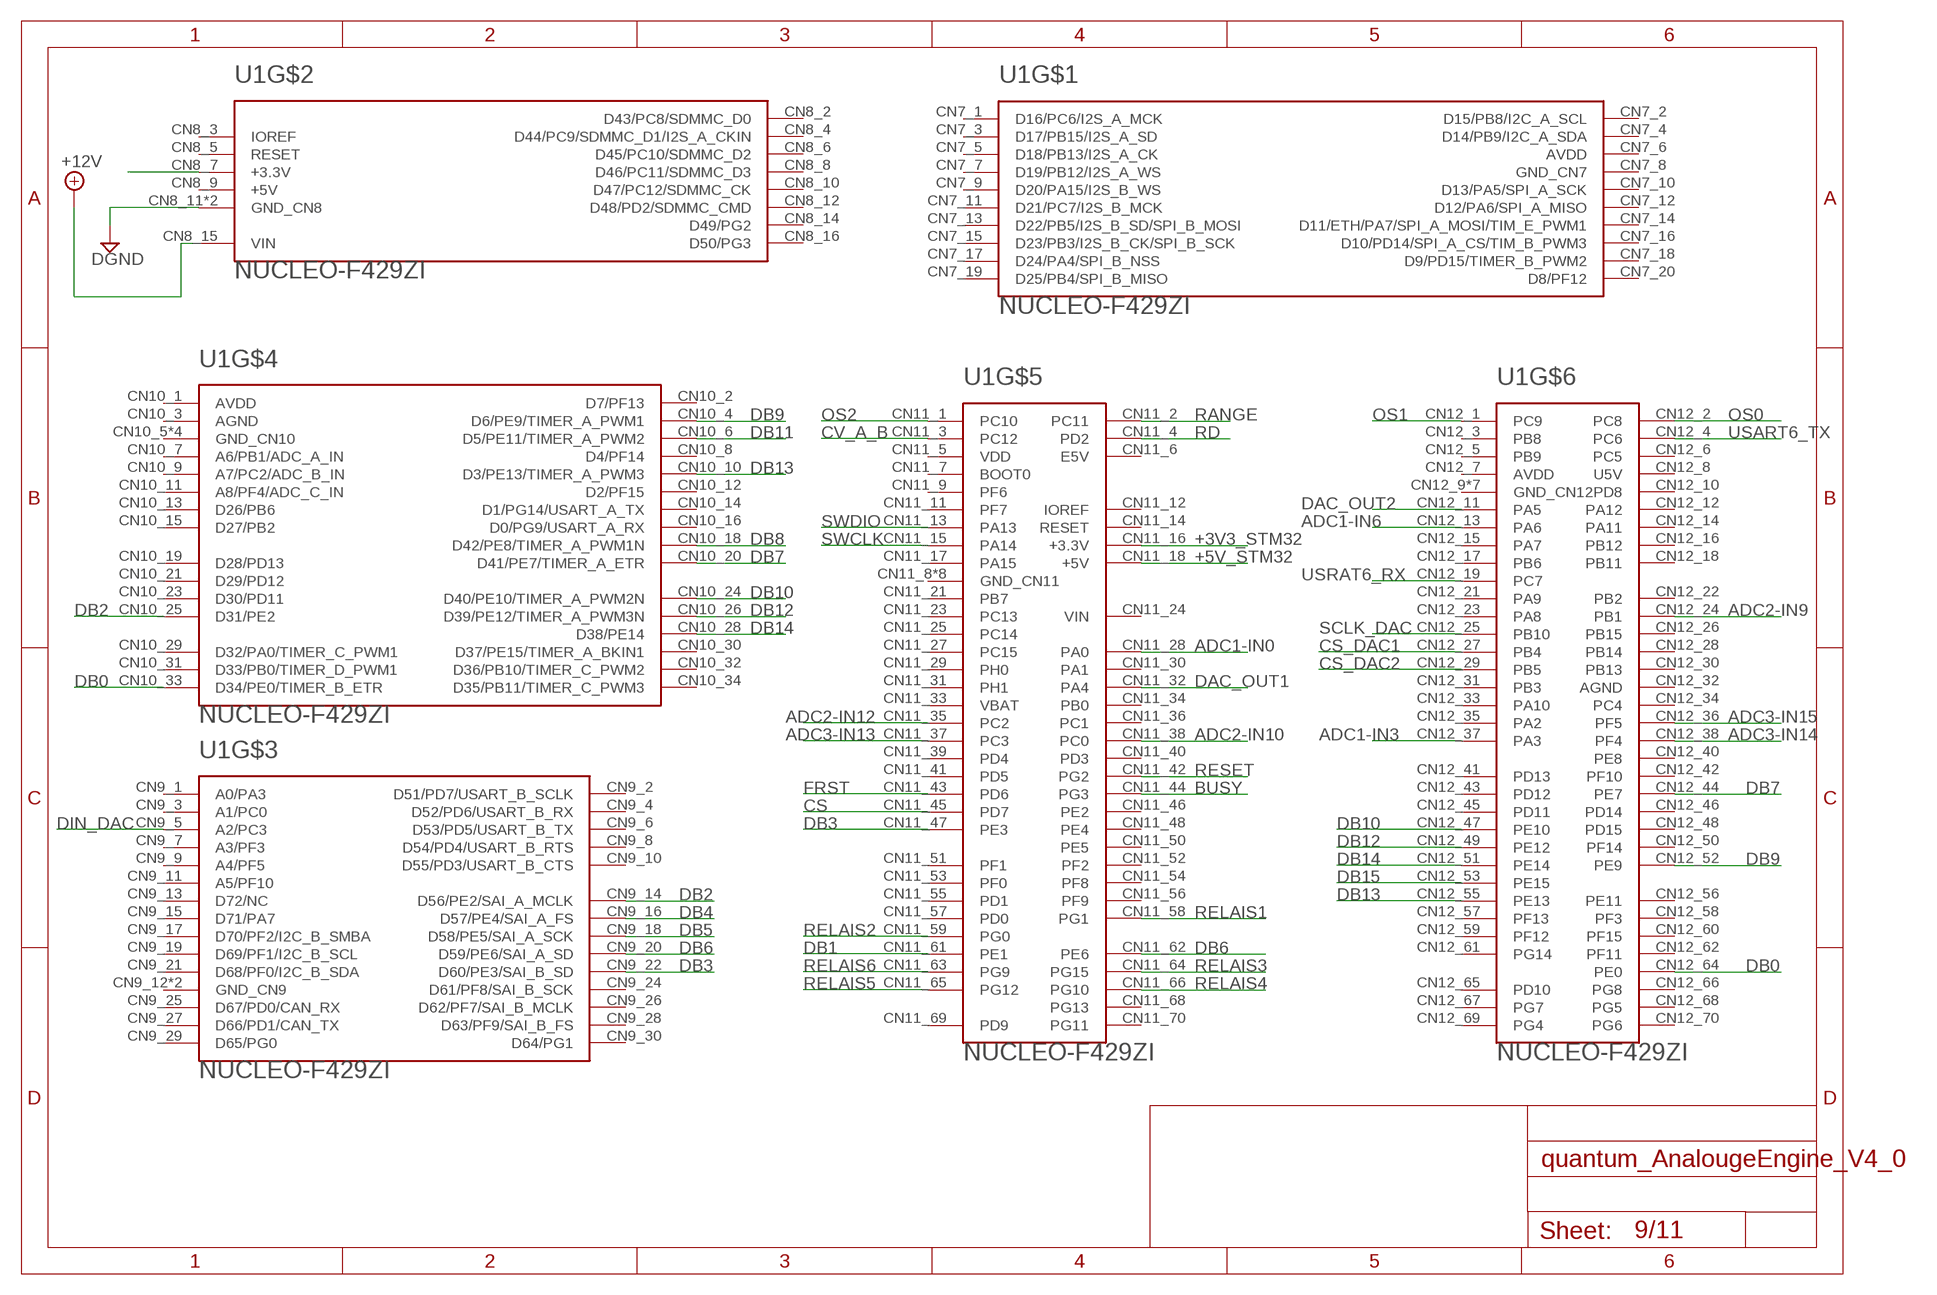
[diagram p8: schematic, sheet 9]

### Parts
U1  NUCLEO-F429ZI  [MODULE_NUCLEO-F429ZI]

### Nets
+3V3_STM32: U1.CN11_16(+3.3V) ; also sheet 10
+5V_STM32: U1.CN11_18(+5V) ; also sheet 10,11
+12V: U1.CN8_15(VIN) ; also sheet 1,2
ADC1-IN0: U1.CN11_28(PA0) ; also sheet 10
ADC1-IN3: U1.CN12_37(PA3) ; also sheet 10
ADC1-IN6: U1.CN12_13(PA6)
ADC2-IN9: U1.CN12_24(PB1)
ADC2-IN10: U1.CN11_38(PC0)
ADC2-IN12: U1.CN11_35(PC2)
ADC3-IN13: U1.CN11_37(PC3)
ADC3-IN14: U1.CN12_38(PF4)
ADC3-IN15: U1.CN12_36(PF5)
BUSY: U1.CN11_44(PG3) ; also sheet 10
CS: U1.CN11_45(PD7) ; also sheet 10
CS_DAC1: U1.CN12_27(PB4) ; also sheet 11
CS_DAC2: U1.CN12_29(PB5) ; also sheet 11
CV_A_B: U1.CN11_3(PC12) ; also sheet 10
DAC_OUT1: U1.CN11_32(PA4) ; also sheet 6
DAC_OUT2: U1.CN12_11(PA5) ; also sheet 6
DB0: U1.CN10_33(D34/PE0/TIMER_B_ETR) U1.CN12_64(PE0) ; also sheet 10
DB1: U1.CN11_61(PE1) ; also sheet 10
DB2: U1.CN9_14(D56/PE2/SAI_A_MCLK) U1.CN10_25(D31/PE2) ; also sheet 10
DB3: U1.CN9_22(D60/PE3/SAI_B_SD) U1.CN11_47(PE3) ; also sheet 10
DB4: U1.CN9_16(D57/PE4/SAI_A_FS) ; also sheet 10
DB5: U1.CN9_18(D58/PE5/SAI_A_SCK) ; also sheet 10
DB6: U1.CN9_20(D59/PE6/SAI_A_SD) U1.CN11_62(PE6) ; also sheet 10
DB7: U1.CN10_20(D41/PE7/TIMER_A_ETR) U1.CN12_44(PE7) ; also sheet 10
DB8: U1.CN10_18(D42/PE8/TIMER_A_PWM1N) ; also sheet 10
DB9: U1.CN10_4(D6/PE9/TIMER_A_PWM1) U1.CN12_52(PE9) ; also sheet 10
DB10: U1.CN10_24(D40/PE10/TIMER_A_PWM2N) U1.CN12_47(PE10) ; also sheet 10
DB11: U1.CN10_6(D5/PE11/TIMER_A_PWM2) ; also sheet 10
DB12: U1.CN10_26(D39/PE12/TIMER_A_PWM3N) U1.CN12_49(PE12) ; also sheet 10
DB13: U1.CN10_10(D3/PE13/TIMER_A_PWM3) U1.CN12_55(PE13) ; also sheet 10
DB14: U1.CN10_28(D38/PE14) U1.CN12_51(PE14) ; also sheet 10
DB15: U1.CN12_53(PE15) ; also sheet 10
DGND: U1.CN8_11(GND_CN8) U1.CN8_13(GND_CN8) ; also sheet 1,2,10,11
DIN_DAC: U1.CN9_5(A2/PC3) ; also sheet 11
FRST: U1.CN11_43(PD6) ; also sheet 10
N$37: U1.CN8_7(+3.3V)
OS0: U1.CN12_2(PC8) ; also sheet 10
OS1: U1.CN12_1(PC9) ; also sheet 10
OS2: U1.CN11_1(PC10) ; also sheet 10
RANGE: U1.CN11_2(PC11) ; also sheet 10
RD: U1.CN11_4(PD2) ; also sheet 10
RELAIS1: U1.CN11_58(PG1) ; also sheet 2
RELAIS2: U1.CN11_59(PG0) ; also sheet 2
RELAIS3: U1.CN11_64(PG15) ; also sheet 2
RELAIS4: U1.CN11_66(PG10) ; also sheet 2
RELAIS5: U1.CN11_65(PG12) ; also sheet 2
RELAIS6: U1.CN11_63(PG9) ; also sheet 2
RESET: U1.CN11_42(PG2) ; also sheet 10
SCLK_DAC: U1.CN12_25(PB10) ; also sheet 11
SWCLK: U1.CN11_15(PA14)
SWDIO: U1.CN11_13(PA13)
USART6_TX: U1.CN12_4(PC6)
USRAT6_RX: U1.CN12_19(PC7)
Unconnected: U1.CN7_1(D16/PC6/I2S_A_MCK) U1.CN7_2(D15/PB8/I2C_A_SCL) U1.CN7_3(D17/PB15/I2S_A_SD) U1.CN7_4(D14/PB9/I2C_A_SDA) U1.CN7_5(D18/PB13/I2S_A_CK) U1.CN7_6(AVDD) U1.CN7_7(D19/PB12/I2S_A_WS) U1.CN7_8(GND_CN7) U1.CN7_9(D20/PA15/I2S_B_WS) U1.CN7_10(D13/PA5/SPI_A_SCK) U1.CN7_11(D21/PC7/I2S_B_MCK) U1.CN7_12(D12/PA6/SPI_A_MISO) U1.CN7_13(D22/PB5/I2S_B_SD/SPI_B_MOSI) U1.CN7_14(D11/ETH/PA7/SPI_A_MOSI/TIM_E_PWM1) U1.CN7_15(D23/PB3/I2S_B_CK/SPI_B_SCK) U1.CN7_16(D10/PD14/SPI_A_CS/TIM_B_PWM3) U1.CN7_17(D24/PA4/SPI_B_NSS) U1.CN7_18(D9/PD15/TIMER_B_PWM2) U1.CN7_19(D25/PB4/SPI_B_MISO) U1.CN7_20(D8/PF12) U1.CN8_2(D43/PC8/SDMMC_D0) U1.CN8_3(IOREF) U1.CN8_4(D44/PC9/SDMMC_D1/I2S_A_CKIN) U1.CN8_5(RESET) U1.CN8_6(D45/PC10/SDMMC_D2) U1.CN8_8(D46/PC11/SDMMC_D3) U1.CN8_9(+5V) U1.CN8_10(D47/PC12/SDMMC_CK) U1.CN8_12(D48/PD2/SDMMC_CMD) U1.CN8_14(D49/PG2) U1.CN8_16(D50/PG3) U1.CN9_1(A0/PA3) U1.CN9_2(D51/PD7/USART_B_SCLK) U1.CN9_3(A1/PC0) U1.CN9_4(D52/PD6/USART_B_RX) U1.CN9_6(D53/PD5/USART_B_TX) U1.CN9_7(A3/PF3) U1.CN9_8(D54/PD4/USART_B_RTS) U1.CN9_9(A4/PF5) U1.CN9_10(D55/PD3/USART_B_CTS) U1.CN9_11(A5/PF10) U1.CN9_12(GND_CN9) U1.CN9_13(D72/NC) U1.CN9_15(D71/PA7) U1.CN9_17(D70/PF2/I2C_B_SMBA) U1.CN9_19(D69/PF1/I2C_B_SCL) U1.CN9_21(D68/PF0/I2C_B_SDA) U1.CN9_23(GND_CN9) U1.CN9_24(D61/PF8/SAI_B_SCK) U1.CN9_25(D67/PD0/CAN_RX) U1.CN9_26(D62/PF7/SAI_B_MCLK) U1.CN9_27(D66/PD1/CAN_TX) U1.CN9_28(D63/PF9/SAI_B_FS) U1.CN9_29(D65/PG0) U1.CN9_30(D64/PG1) U1.CN10_1(AVDD) U1.CN10_2(D7/PF13) U1.CN10_3(AGND) U1.CN10_5(GND_CN10) U1.CN10_7(A6/PB1/ADC_A_IN) U1.CN10_8(D4/PF14) U1.CN10_9(A7/PC2/ADC_B_IN) U1.CN10_11(A8/PF4/ADC_C_IN) U1.CN10_12(D2/PF15) U1.CN10_13(D26/PB6) U1.CN10_14(D1/PG14/USART_A_TX) U1.CN10_15(D27/PB2) U1.CN10_16(D0/PG9/USART_A_RX) U1.CN10_17(GND_CN10) U1.CN10_19(D28/PD13) U1.CN10_21(D29/PD12) U1.CN10_22(GND_CN10) U1.CN10_23(D30/PD11) U1.CN10_27(GND_CN10) U1.CN10_29(D32/PA0/TIMER_C_PWM1) U1.CN10_30(D37/PE15/TIMER_A_BKIN1) U1.CN10_31(D33/PB0/TIMER_D_PWM1) U1.CN10_32(D36/PB10/TIMER_C_PWM2) U1.CN10_34(D35/PB11/TIMER_C_PWM3) U1.CN11_5(VDD) U1.CN11_6(E5V) U1.CN11_7(BOOT0) U1.CN11_8(GND_CN11) U1.CN11_9(PF6) U1.CN11_11(PF7) U1.CN11_12(IOREF) U1.CN11_14(RESET) U1.CN11_17(PA15) U1.CN11_19(GND_CN11) U1.CN11_20(GND_CN11) U1.CN11_21(PB7) U1.CN11_22(GND_CN11) U1.CN11_23(PC13) U1.CN11_24(VIN) U1.CN11_25(PC14) U1.CN11_27(PC15) U1.CN11_29(PH0) U1.CN11_30(PA1) U1.CN11_31(PH1) U1.CN11_33(VBAT) U1.CN11_34(PB0) U1.CN11_36(PC1) U1.CN11_39(PD4) U1.CN11_40(PD3) U1.CN11_41(PD5) U1.CN11_46(PE2) U1.CN11_48(PE4) U1.CN11_49(GND_CN11) U1.CN11_50(PE5) U1.CN11_51(PF1) U1.CN11_52(PF2) U1.CN11_53(PF0) U1.CN11_54(PF8) U1.CN11_55(PD1) U1.CN11_56(PF9) U1.CN11_57(PD0) U1.CN11_60(GND_CN11) U1.CN11_68(PG13) U1.CN11_69(PD9) U1.CN11_70(PG11) U1.CN11_71(GND_CN11) U1.CN11_72(GND_CN11) U1.CN12_3(PB8) U1.CN12_5(PB9) U1.CN12_6(PC5) U1.CN12_7(AVDD) U1.CN12_8(U5V) U1.CN12_9(GND_CN12) U1.CN12_10(PD8) U1.CN12_12(PA12) U1.CN12_14(PA11) U1.CN12_15(PA7) U1.CN12_16(PB12) U1.CN12_17(PB6) U1.CN12_18(PB11) U1.CN12_20(GND_CN12) U1.CN12_21(PA9) U1.CN12_22(PB2) U1.CN12_23(PA8) U1.CN12_26(PB15) U1.CN12_28(PB14) U1.CN12_30(PB13) U1.CN12_31(PB3) U1.CN12_32(AGND) U1.CN12_33(PA10) U1.CN12_34(PC4) U1.CN12_35(PA2) U1.CN12_39(GND_CN12) U1.CN12_40(PE8) U1.CN12_41(PD13) U1.CN12_42(PF10) U1.CN12_43(PD12) U1.CN12_45(PD11) U1.CN12_46(PD14) U1.CN12_48(PD15) U1.CN12_50(PF14) U1.CN12_54(GND_CN12) U1.CN12_56(PE11) U1.CN12_57(PF13) U1.CN12_58(PF3) U1.CN12_59(PF12) U1.CN12_60(PF15) U1.CN12_61(PG14) U1.CN12_62(PF11) U1.CN12_63(GND_CN12) U1.CN12_65(PD10) U1.CN12_66(PG8) U1.CN12_67(PG7) U1.CN12_68(PG5) U1.CN12_69(PG4) U1.CN12_70(PG6) U1.CN12_71(GND_CN12) U1.CN12_72(GND_CN12)

## Sheet 10 of 11: AD Converter
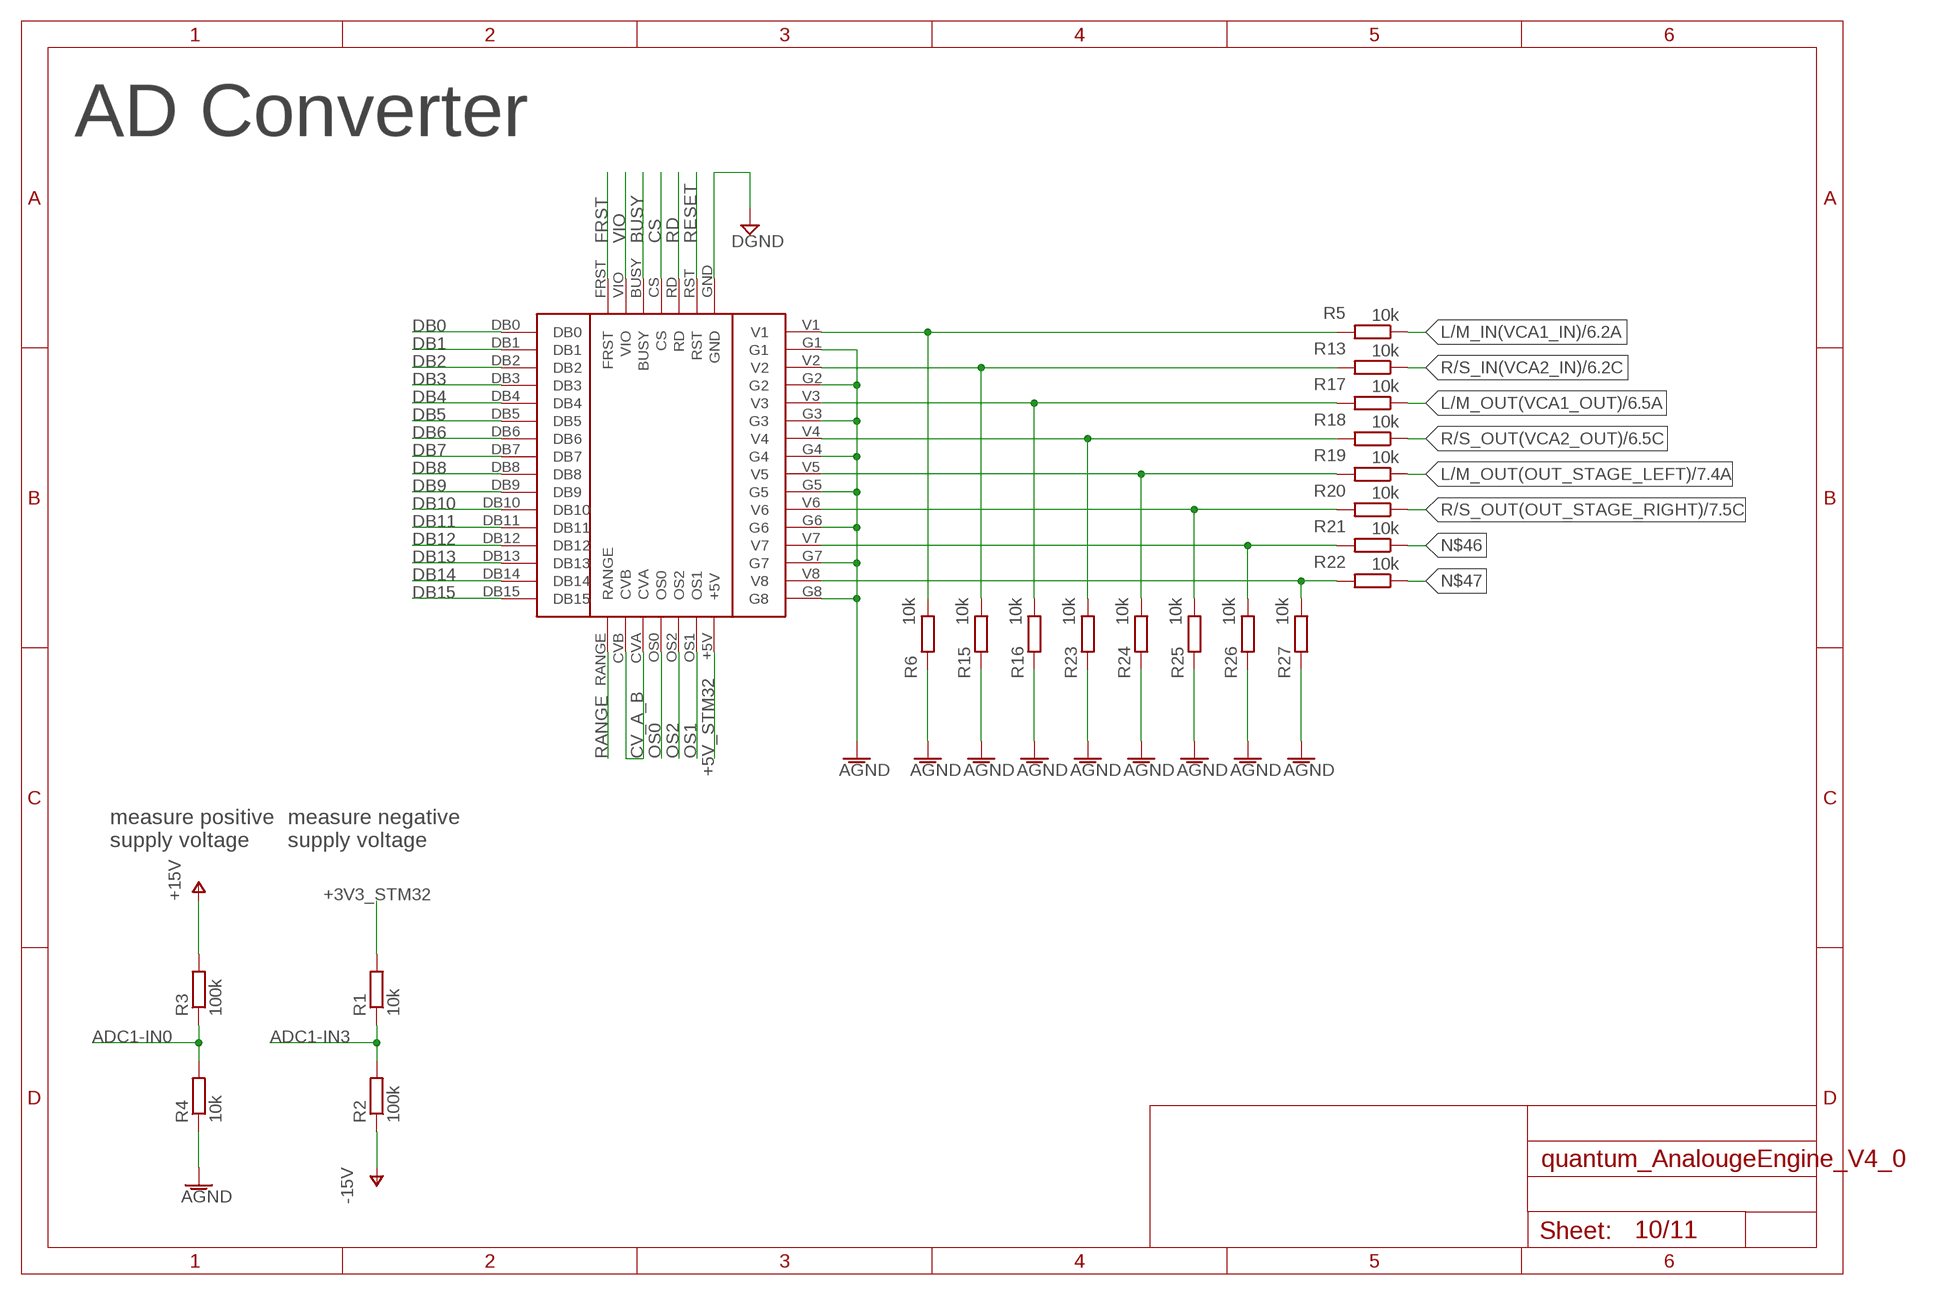
[diagram p9: schematic, sheet 10]

### Parts
R1  10k  RESISTOR  [R0603]
R2  100k  RESISTOR  [R0603]
R3  100k  RESISTOR  [R0603]
R4  10k  RESISTOR  [R0603]
R5  10k  RESISTOR  [R0603]
R6  10k  RESISTOR  [R0603]
R13  10k  RESISTOR  [R0603]
R15  10k  RESISTOR  [R0603]
R16  10k  RESISTOR  [R0603]
R17  10k  RESISTOR  [R0603]
R18  10k  RESISTOR  [R0603]
R19  10k  RESISTOR  [R0603]
R20  10k  RESISTOR  [R0603]
R21  10k  RESISTOR  [R0603]
R22  10k  RESISTOR  [R0603]
R23  10k  RESISTOR  [R0603]
R24  10k  RESISTOR  [R0603]
R25  10k  RESISTOR  [R0603]
R26  10k  RESISTOR  [R0603]
R27  10k  RESISTOR  [R0603]
U3  AD7606_EVALBOARD  [AD7606_EVALBOARD]

### Nets
+3V3_STM32: R1.2 ; also sheet 9
+5V_STM32: U3.+5V ; also sheet 9,11
ADC1-IN0: R3.1 R4.2 ; also sheet 9
ADC1-IN3: R1.1 R2.2 ; also sheet 9
AGND: R4.1 R6.1 R15.1 R16.1 R23.1 R24.1 R25.1 R26.1 R27.1 U3.G1 U3.G2 U3.G3 U3.G4 U3.G5 U3.G6 U3.G7 U3.G8 ; also sheet 1,3,4,5,6,7,8,11
BUSY: U3.BUSY ; also sheet 9
CS: U3.CS ; also sheet 9
CV_A_B: U3.CVA U3.CVB ; also sheet 9
DB0: U3.DB0 ; also sheet 9
DB1: U3.DB1 ; also sheet 9
DB2: U3.DB2 ; also sheet 9
DB3: U3.DB3 ; also sheet 9
DB4: U3.DB4 ; also sheet 9
DB5: U3.DB5 ; also sheet 9
DB6: U3.DB6 ; also sheet 9
DB7: U3.DB7 ; also sheet 9
DB8: U3.DB8 ; also sheet 9
DB9: U3.DB9 ; also sheet 9
DB10: U3.DB10 ; also sheet 9
DB11: U3.DB11 ; also sheet 9
DB12: U3.DB12 ; also sheet 9
DB13: U3.DB13 ; also sheet 9
DB14: U3.DB14 ; also sheet 9
DB15: U3.DB15 ; also sheet 9
DGND: U3.GND ; also sheet 1,2,9,11
FRST: U3.FRST ; also sheet 9
L/M_IN(VCA1_IN): R5.1 ; also sheet 5,6
L/M_OUT(OUT_STAGE_LEFT): R19.1 ; also sheet 7,8
L/M_OUT(VCA1_OUT): R17.1 ; also sheet 6,7
N$4: R5.2 R6.2 U3.V1
N$6: R13.2 R15.2 U3.V2
N$10: R16.2 R17.2 U3.V3
N$12: R18.2 R23.2 U3.V4
N$20: R19.2 R24.2 U3.V5
N$34: R20.2 R25.2 U3.V6
N$35: R21.2 R26.2 U3.V7
N$36: R22.2 R27.2 U3.V8
N$46: R21.1
N$47: R22.1
OS0: U3.OS0 ; also sheet 9
OS1: U3.OS1 ; also sheet 9
OS2: U3.OS2 ; also sheet 9
R/S_IN(VCA2_IN): R13.1 ; also sheet 5,6
R/S_OUT(OUT_STAGE_RIGHT): R20.1 ; also sheet 7,8
R/S_OUT(VCA2_OUT): R18.1 ; also sheet 6,7
RANGE: U3.RANGE ; also sheet 9
RD: U3.RD ; also sheet 9
RESET: U3.RST ; also sheet 9
V+: R3.2 ; supply symbol labelled +15V ; also sheet 1,3,4,5,6,7,8,11
V-: R2.1 ; supply symbol labelled -15V ; also sheet 1,3,4,5,6,7,8,11
VIO: U3.VIO

### Notes on the sheet
- AD Converter
- measure positive 
  supply voltage
- measure negative 
  supply voltage

## Sheet 11 of 11: DA Converter
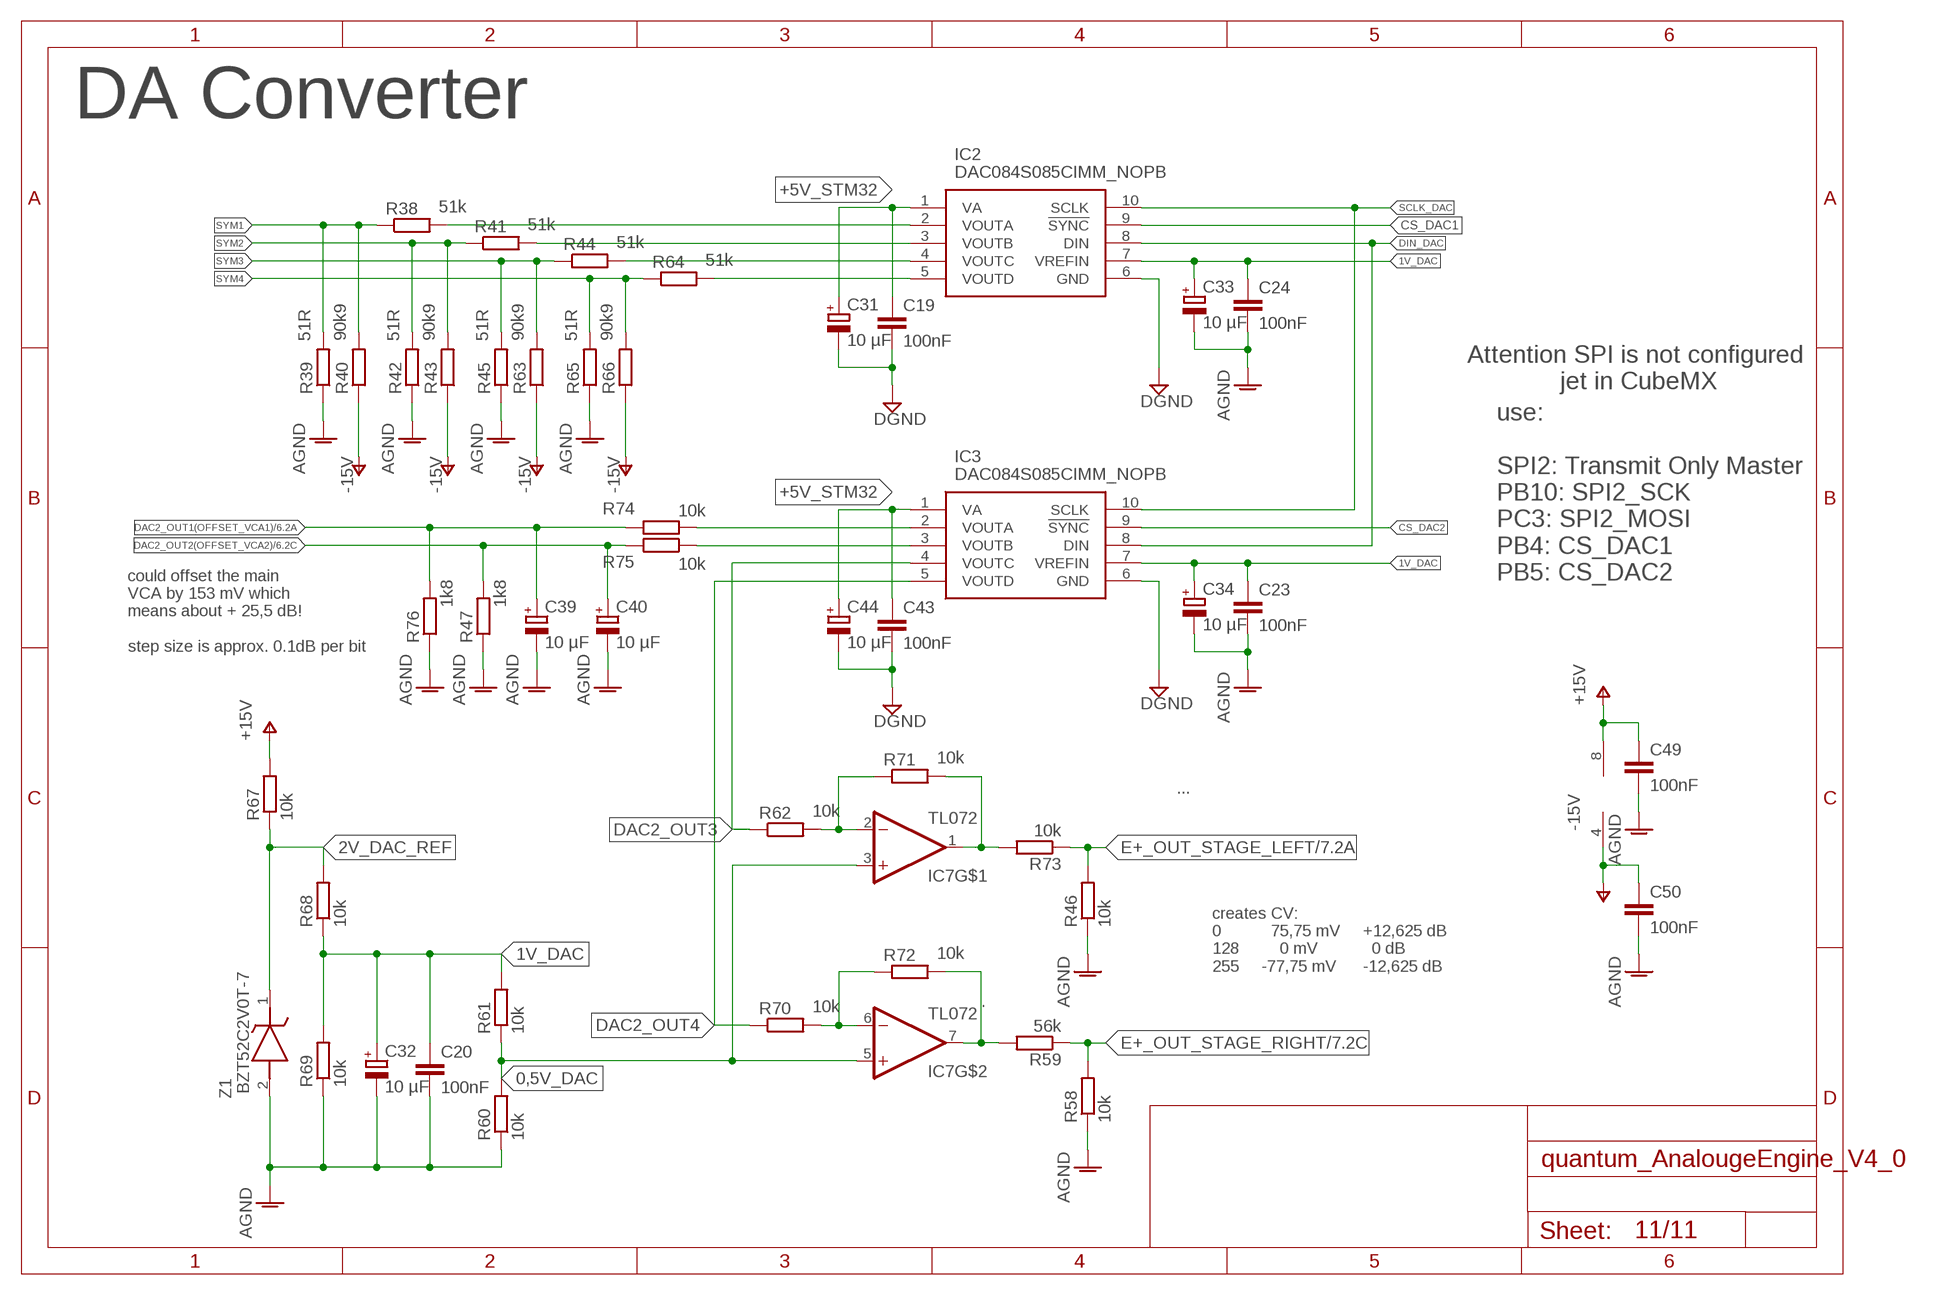
[diagram p10: schematic, sheet 11]

### Parts
C19  100nF  CAPACITOR"  [C0603]
C20  100nF  CAPACITOR"  [C0603]
C23  100nF  CAPACITOR"  [C0603]
C24  100nF  CAPACITOR"  [C0603]
C31  10 µF  ELECTROLYTICELCTROLYTIC_MIDSIZE_SMD  [CAPAE400X550N]
C32  10 µF  ELECTROLYTICELCTROLYTIC_MIDSIZE_SMD  [CAPAE400X550N]
C33  10 µF  ELECTROLYTICELCTROLYTIC_MIDSIZE_SMD  [CAPAE400X550N]
C34  10 µF  ELECTROLYTICELCTROLYTIC_MIDSIZE_SMD  [CAPAE400X550N]
C39  10 µF  ELECTROLYTICELCTROLYTIC_MIDSIZE_SMD  [CAPAE400X550N]
C40  10 µF  ELECTROLYTICELCTROLYTIC_MIDSIZE_SMD  [CAPAE400X550N]
C43  100nF  CAPACITOR"  [C0603]
C44  10 µF  ELECTROLYTICELCTROLYTIC_MIDSIZE_SMD  [CAPAE400X550N]
C49  100nF  CAPACITOR"  [C0603]
C50  100nF  CAPACITOR"  [C0603]
IC2  DAC084S085CIMM_NOPB  [SOP50P490X110-10N]
IC3  DAC084S085CIMM_NOPB  [SOP50P490X110-10N]
IC7  TL072  [SOIC8]
R38  51k  RESISTOR  [R0603]
R39  51R  RESISTOR  [R0603]
R40  90k9  RESISTOR  [R0603]
R41  51k  RESISTOR  [R0603]
R42  51R  RESISTOR  [R0603]
R43  90k9  RESISTOR  [R0603]
R44  51k  RESISTOR  [R0603]
R45  51R  RESISTOR  [R0603]
R46  10k  RESISTOR  [R0603]
R47  1k8  RESISTOR  [R0603]
R58  10k  RESISTOR  [R0603]
R59  56k  RESISTOR  [R0603]
R60  10k  RESISTOR  [R0603]
R61  10k  RESISTOR  [R0603]
R62  10k  RESISTOR  [R0603]
R63  90k9  RESISTOR  [R0603]
R64  51k  RESISTOR  [R0603]
R65  51R  RESISTOR  [R0603]
R66  90k9  RESISTOR  [R0603]
R67  10k  RESISTOR  [R0603]
R68  10k  RESISTOR  [R0603]
R69  10k  RESISTOR  [R0603]
R70  10k  RESISTOR  [R0603]
R71  10k  RESISTOR  [R0603]
R72  10k  RESISTOR  [R0603]
R73  10k  RESISTOR  [R0603]
R74  10k  RESISTOR  [R0603]
R75  10k  RESISTOR  [R0603]
R76  1k8  RESISTOR  [R0603]
Z1  BZT52C2V0T-7  [SODFL1608X65N]

### Nets
0,5V_DAC: IC7.3(+IN) IC7.5(+IN) R60.2 R61.1
1V_DAC: C20.1 C23.1 C24.1 C32.1(+) C33.1(+) C34.1(+) IC2.7(VREFIN) IC3.7(VREFIN) R61.2 R68.1 R69.2
2V_DAC_REF: R67.1 R68.2 Z1.1(K)
+5V_STM32: C19.1 C31.1(+) C43.1 C44.1(+) IC2.1(VA) IC3.1(VA) ; also sheet 9,10
.: IC7.7(OUT) R59.2 R72.2
...: IC7.1(OUT) R71.2 R73.2
AGND: C20.2 C23.2 C24.2 C32.2(-) C33.2(-) C34.2(-) C39.2(-) C40.2(-) C49.2 C50.2 R39.1 R42.1 R45.1 R46.1 R47.1 R58.1 R60.1 R65.1 R69.1 R76.1 Z1.2(A) ; also sheet 1,3,4,5,6,7,8,10
CS_DAC1: IC2.9(!SYNC) ; also sheet 9
CS_DAC2: IC3.9(!SYNC) ; also sheet 9
DAC2_OUT1(OFFSET_VCA1): C39.1(+) R74.2 R76.2 ; also sheet 6
DAC2_OUT2(OFFSET_VCA2): C40.1(+) R47.2 R75.2 ; also sheet 6
DAC2_OUT3: IC3.4(VOUTC) R62.1
DAC2_OUT4: IC3.5(VOUTD) R70.1
DGND: C19.2 C31.2(-) C43.2 C44.2(-) IC2.6(GND) IC3.6(GND) ; also sheet 1,2,9,10
DIN_DAC: IC2.8(DIN) IC3.8(DIN) ; also sheet 9
E+_OUT_STAGE_LEFT: R46.2 R73.1 ; also sheet 7
E+_OUT_STAGE_RIGHT: R58.2 R59.1 ; also sheet 7
N$56: IC2.2(VOUTA) R38.2
N$57: IC2.3(VOUTB) R41.2
N$58: IC2.4(VOUTC) R44.2
N$59: IC2.5(VOUTD) R64.2
N$60: IC3.2(VOUTA) R74.1
N$61: IC3.3(VOUTB) R75.1
N$72: IC7.2(-IN) R62.2 R71.1
N$74: IC7.6(-IN) R70.2 R72.1
SCLK_DAC: IC2.10(SCLK) IC3.10(SCLK) ; also sheet 9
SYM1: R38.1 R39.2 R40.2 ; also sheet 6
SYM2: R41.1 R42.2 R43.2 ; also sheet 6
SYM3: R44.1 R45.2 R63.2 ; also sheet 7
SYM4: R64.1 R65.2 R66.2 ; also sheet 7
V+: C49.1 IC7.8(V+) R67.2 ; supply symbol labelled +15V ; also sheet 1,3,4,5,6,7,8,10
V-: C50.1 IC7.4(V-) R40.1 R43.1 R63.1 R66.1 ; supply symbol labelled -15V ; also sheet 1,3,4,5,6,7,8,10

### Notes on the sheet
- DA Converter
- Attention SPI is not configured 
  jet in CubeMX
- use:
  
  SPI2: Transmit Only Master
  PB10: SPI2_SCK
  PC3: SPI2_MOSI
  PB4: CS_DAC1
  PB5: CS_DAC2
- could offset the main 
  VCA by 153 mV which
  means about + 25,5 dB! 
  
  step size is approx. 0.1dB per bit
- creates CV:
  0           75,75 mV     +12,625 dB
  128         0 mV            0 dB
  255     -77,75 mV      -12,625 dB

## Library data of the parts
C1-C30 C35-C38 C43 C45-C50 C53-C58 C60-C63 C69 C70 = C_Sager_Bibliothek:CAPACITOR: capacitor
C31-C34 C39 C40 C44 C67 C68 = C_Sager_Bibliothek:ELECTROLYTIC: Electrolytic Capacitor SMD
CONN3 = C_Sager_Bibliothek:SCHRAUBKLEMME_3POL: WAGO SCREW CLAMP
IC1 IC4 IC5 IC8 = C_Sager_Bibliothek:OP275: Dual Very Low Noise Precision Operational Amplifier Source: http://www.analog.com/static/imported-files/data_sheets/OP270.pdf; MOUSER_PART_NUMBER: 584-OP275GSZ-R7
IC2 IC3 = SPI:DAC084S085CIMM_NOPB: 8-Bit Micro Power QUAD Digital-to-Analog Converter with Rail-to-Rail Output Source: Datasheet <http://www.ti.com/general/docs/suppproductinfo.tsp?distId=10&gotoUrl=http://www.ti.com/lit/gpn/dac084s085>; MOUSER_PART_NUMBER: 926-DAC084S085CIMMNO
IC7 IC9 = C_Sager_Bibliothek:TL072: Operational Amplifier; MOUSER_PART_NUMBER: 595-TL072CDR
IN1(R/S) IN2(L/M) = C_Sager_Bibliothek:NEUTRIK_NC3FAH: XLR Connectors Female; MOUSER_PART_NUMBER: 568-NC3FAH
IN_LEFT IN_RIGHT U4 U6-U8 = THAT_Library:THAT1240: Balanced Line Receiver THAT1240, THAT1243, THAT1246; MOUSER_PART_NUMBER: 887-1240S08-U
K1-K8 = C_Sager_Bibliothek:RELAY_EE2-5NU: RELAY SPST; MOUSER_PART_NUMBER: 80-EE2-12NU
LED1-LED4 LED6-LED8 = C_Sager_Bibliothek:LED: LED; MOUSER_PART_NUMBER: 710-150060BS75000
LED5 = C_Sager_Bibliothek:LED: LED; MOUSER_PART_NUMBER: 710-150060BS75000; SPICEPREFIX: L
LED9 LED10 = C_Sager_Bibliothek:LED: LED; MOUSER_PART_NUMBER: 710-150060VS75000
OUT1(R/S) OUT2(L/M) = C_Sager_Bibliothek:NEUTRIK_NC3MAH: XLR Connectors Male; MOUSER_PART_NUMBER: 568-NC3MAH
OUT_LEFT OUT_RIGHT = THAT_Library:THAT1646: Outsmarts Balanced Line Driver; MOUSER_PART_NUMBER: 887-1646S08-U
R1 R3 R5 R7 R8 R13 R17-R22 = C_Sager_Bibliothek:RESISTOR: +/- 5 % resistor; SPICEPREFIX: R
R2 R4 R6 R9-R12 R14-R16 R23-R77 = C_Sager_Bibliothek:RESISTOR: +/- 5 % resistor
STAGE(LEFT) STAGE(RIGHT) VCA1(LEFT) VCA2(RIGHT) = THAT_Library:THAT2181: VCA Trimmable IC; MOUSER_PART_NUMBER: 887-2181CS08-U
TP01-TP06 TP09 TP16 TP18 TP23 TP36 TP37 = C_Sager_Bibliothek:TP
U1 = STM32_144:NUCLEO-F429ZI: STM32 Nucleo-144 development board
U2 = C_Sager_Bibliothek:78**; MOUSER_PART_NUMBER: 513-NJM7812DL1A-TE1
U3 = C_Sager_Bibliothek:AD7606_EVALBOARD
U12 = C_Sager_Bibliothek:ULN2003: Darlington Transistors DARLINGTON TRNS ARRY; MOUSER_PART_NUMBER: 863-ULN2003ADR2G
Z1 = C_Sager_Bibliothek:BZT52C2V0T-7: Diodes Inc BZT52C2V0T-7 Zener Diode, 2.4V 5% 300 mW SMT 2-Pin SOD-523 Source: Datasheet <https://componentsearchengine.com/Datasheets/1/BZT52C2V0T-7.pdf>; MOUSER_PART_NUMBER: 621-BZT52C2V0T-7